# EAGLE schematic rt1060 (EAGLE 9.6.2), part 1 of 2

## Sheet 1 of 15
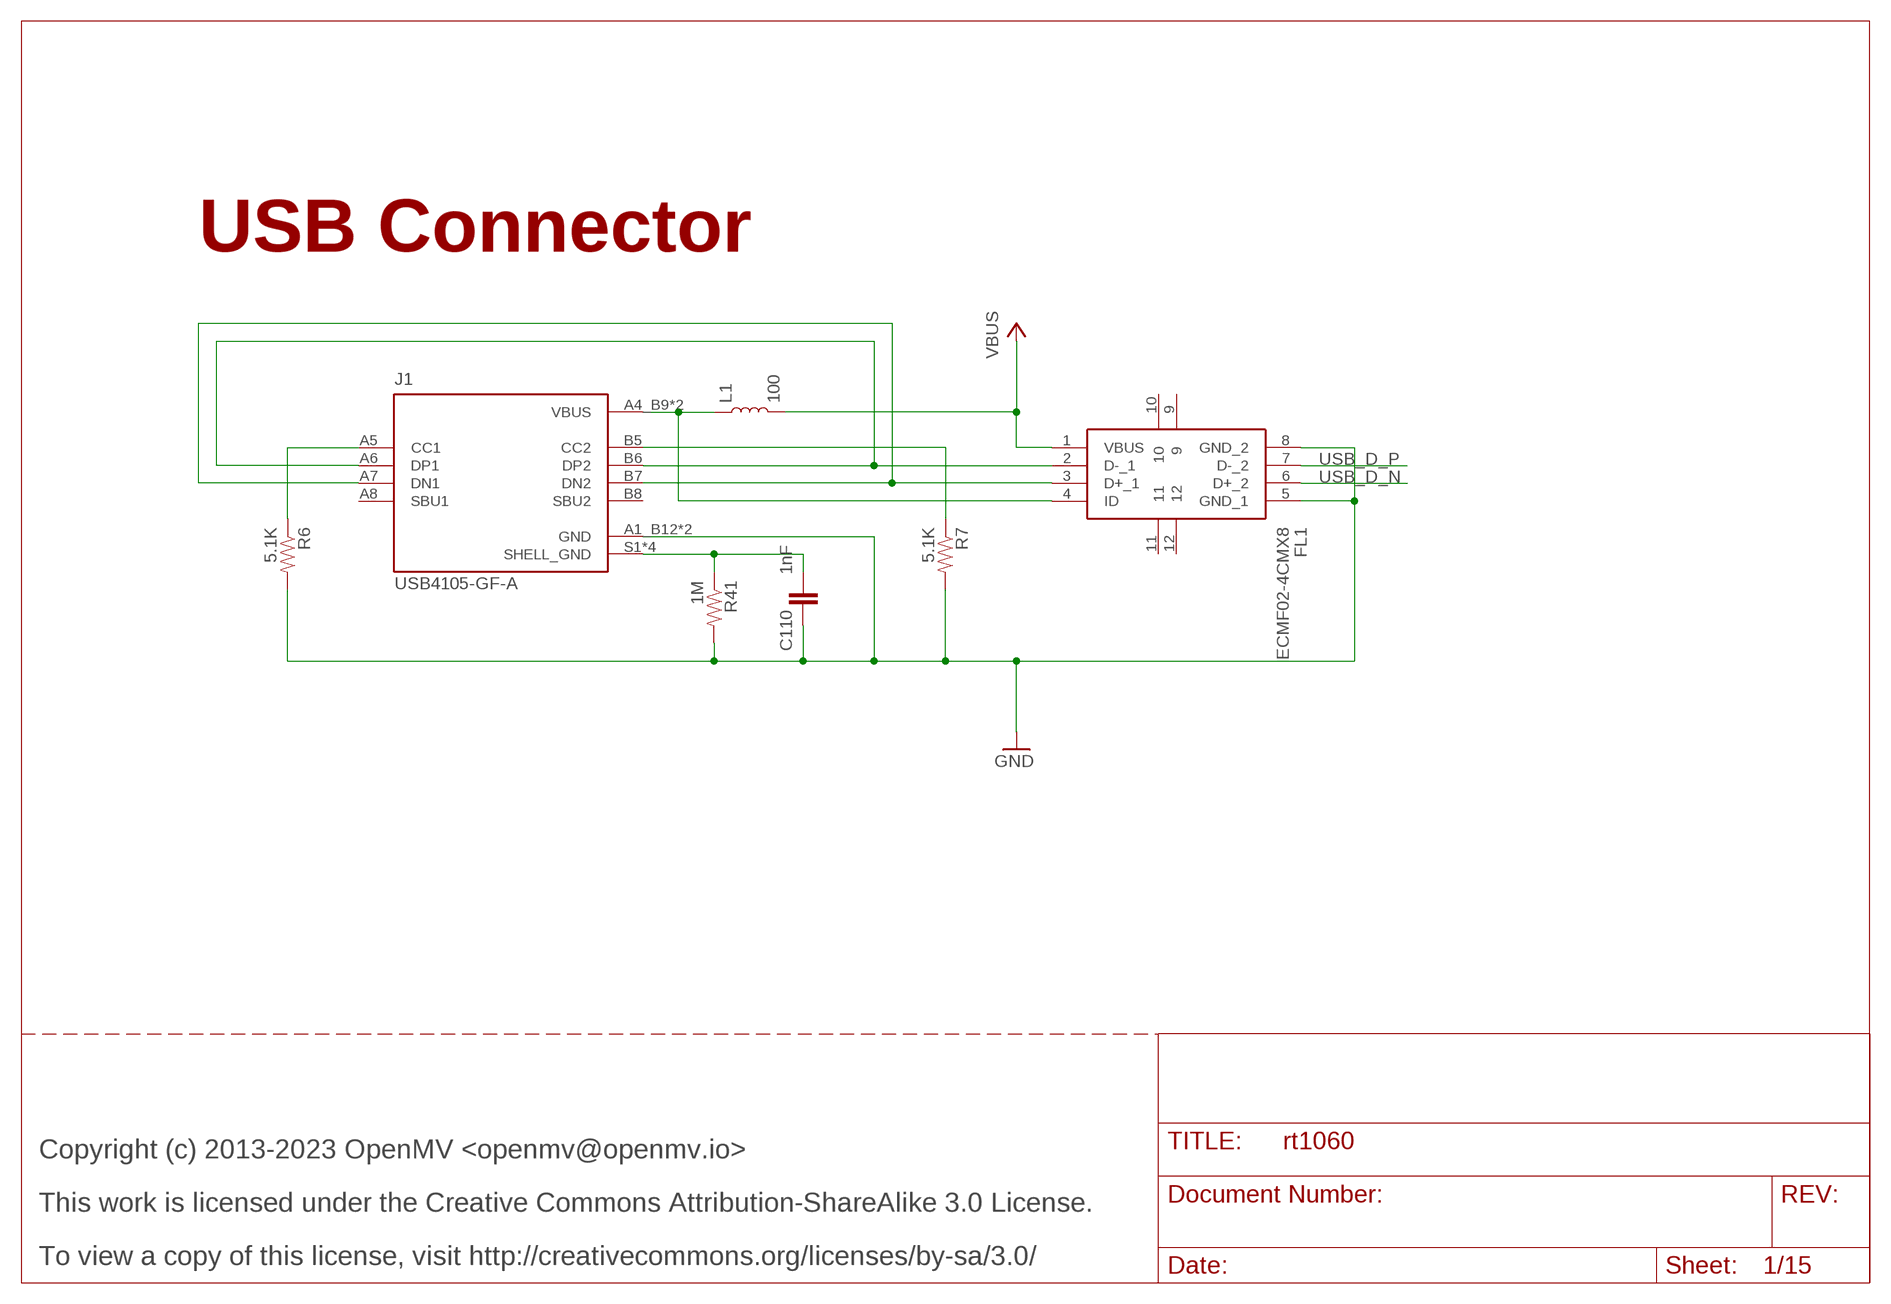
[diagram p0: schematic, sheet 1]

### Parts
C110  1nF  CAP0402-CAP  [0402-CAP]
FL1  ECMF02-4CMX8  [ECMF024CMX8]
J1  USB4105-GF-A  [GCT_USB4105-GF-A]
L1  100  INDUCTOR-0603-33NH  [0603]
R6  5.1K  RESISTOR0402-RES  [0402-RES]
R7  5.1K  RESISTOR0402-RES  [0402-RES]
R41  1M  RESISTOR0402-RES  [0402-RES]

### Nets
CC1: J1.A5(CC1) R6.1
CC2: J1.B5(CC2) R7.1
D_N [usb]: FL1.3(D+_1) J1.A7(DN1) J1.B7(DN2)
D_P [usb]: FL1.2(D-_1) J1.A6(DP1) J1.B6(DP2)
GND [gnd]: C110.1 FL1.5(GND_1) FL1.8(GND_2) J1.A1_B12(GND) J1.B1_A12(GND) R6.2 R7.2 R41.2 ; also sheet 2,3,4,5,6,7,8,9,10,11,12,13,14,15
SHELL_GND [power]: C110.2 J1.S1(SHELL_GND) J1.S2(SHELL_GND) J1.S3(SHELL_GND) J1.S4(SHELL_GND) R41.1
USB_D_N [usb]: FL1.6(D+_2) ; also sheet 15
USB_D_P [usb]: FL1.7(D-_2) ; also sheet 15
USB_VBUS: FL1.4(ID) J1.A4_B9(VBUS) J1.B4_A9(VBUS) L1.1
VBUS: FL1.1(VBUS) L1.2 ; also sheet 2,15
Unconnected: FL1.9 FL1.10 FL1.11 FL1.12 J1.A8(SBU1) J1.B8(SBU2)

### Notes on the sheet
- USB Connector
- Copyright (c) 2013-2023 OpenMV <openmv@openmv.io>
- This work is licensed under the Creative Commons Attribution-ShareAlike 3.0 License.
- To view a copy of this license, visit http://creativecommons.org/licenses/by-sa/3.0/

## Sheet 2 of 15
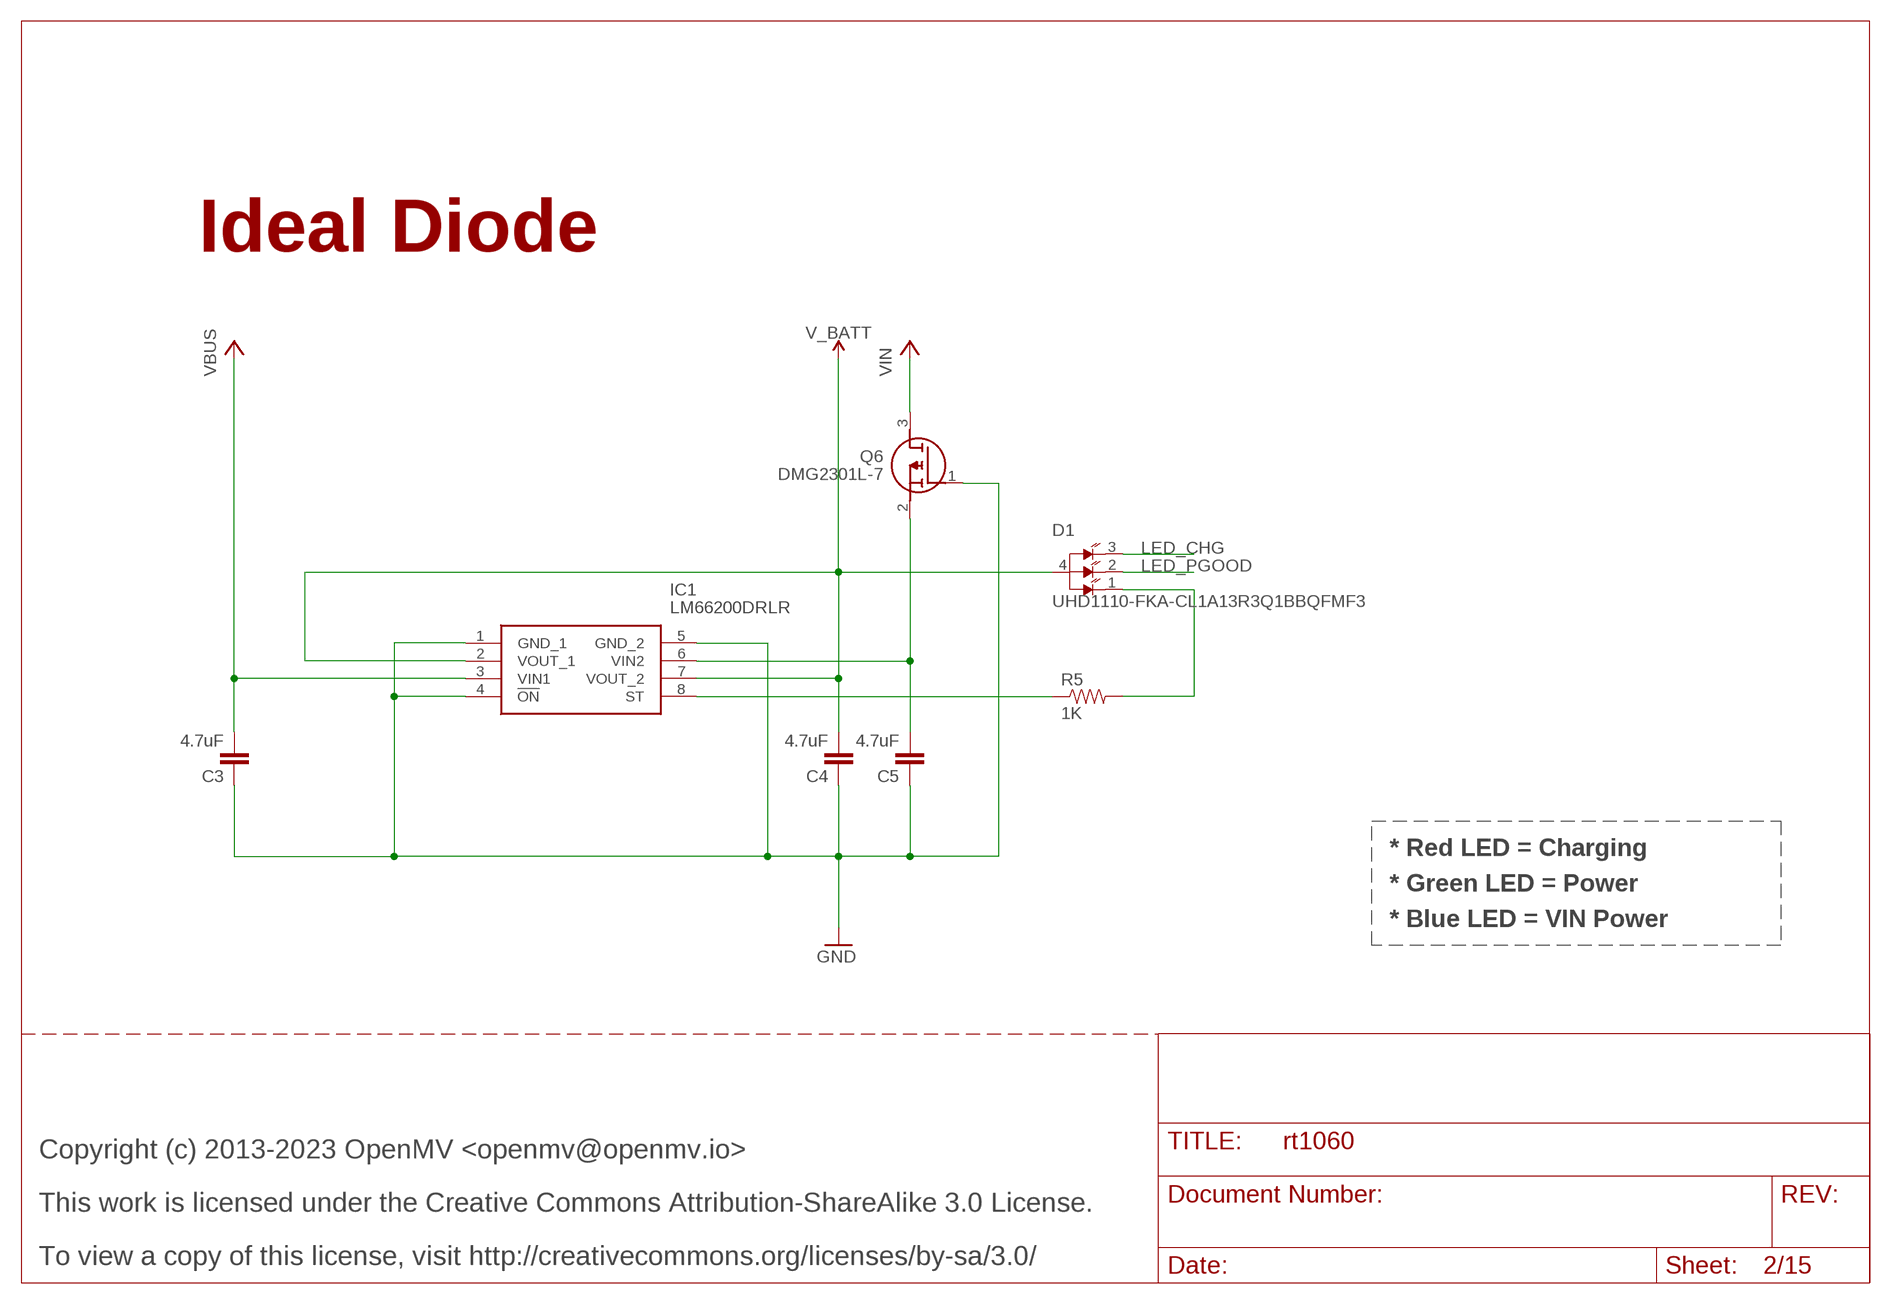
[diagram p1: schematic, sheet 2]

### Parts
C3  4.7uF  CAP0402-CAP  [0402-CAP]
C4  4.7uF  CAP0402-CAP  [0402-CAP]
C5  4.7uF  CAP0402-CAP  [0402-CAP]
D1  UHD1110-FKA-CL1A13R3Q1BBQFMF3  [LED_UHD1110-FKA-CL1A13R3Q1BBQFMF3]
IC1  LM66200DRLR  [SOTFL50P160X60-8N]
Q6  DMG2301L-7  [SOT96P240X110-3N]
R5  1K  RESISTOR0402-RES  [0402-RES]

### Nets
GND [gnd]: C3.1 C4.1 C5.1 IC1.1(GND_1) IC1.4(!ON) IC1.5(GND_2) Q6.1(G) ; also sheet 1,3,4,5,6,7,8,9,10,11,12,13,14,15
LED_CHG: D1.3(RED) ; also sheet 3
LED_PGOOD: D1.2(GREEN) ; also sheet 3
LED_ST: D1.1(BLUE) R5.2
ST: IC1.8(ST) R5.1
V_BATT [power]: C4.2 D1.4(ANODE) IC1.2(VOUT_1) IC1.7(VOUT_2) ; also sheet 3
VBUS: C3.2 IC1.3(VIN1) ; also sheet 1,15
VIN [power]: Q6.3(D) ; also sheet 11
VIN_INT [power]: C5.2 IC1.6(VIN2) Q6.2(S)

### Notes on the sheet
- Ideal Diode
- * Red LED = Charging
- * Green LED = Power
- * Blue LED = VIN Power
- Copyright (c) 2013-2023 OpenMV <openmv@openmv.io>
- This work is licensed under the Creative Commons Attribution-ShareAlike 3.0 License.
- To view a copy of this license, visit http://creativecommons.org/licenses/by-sa/3.0/

## Sheet 3 of 15
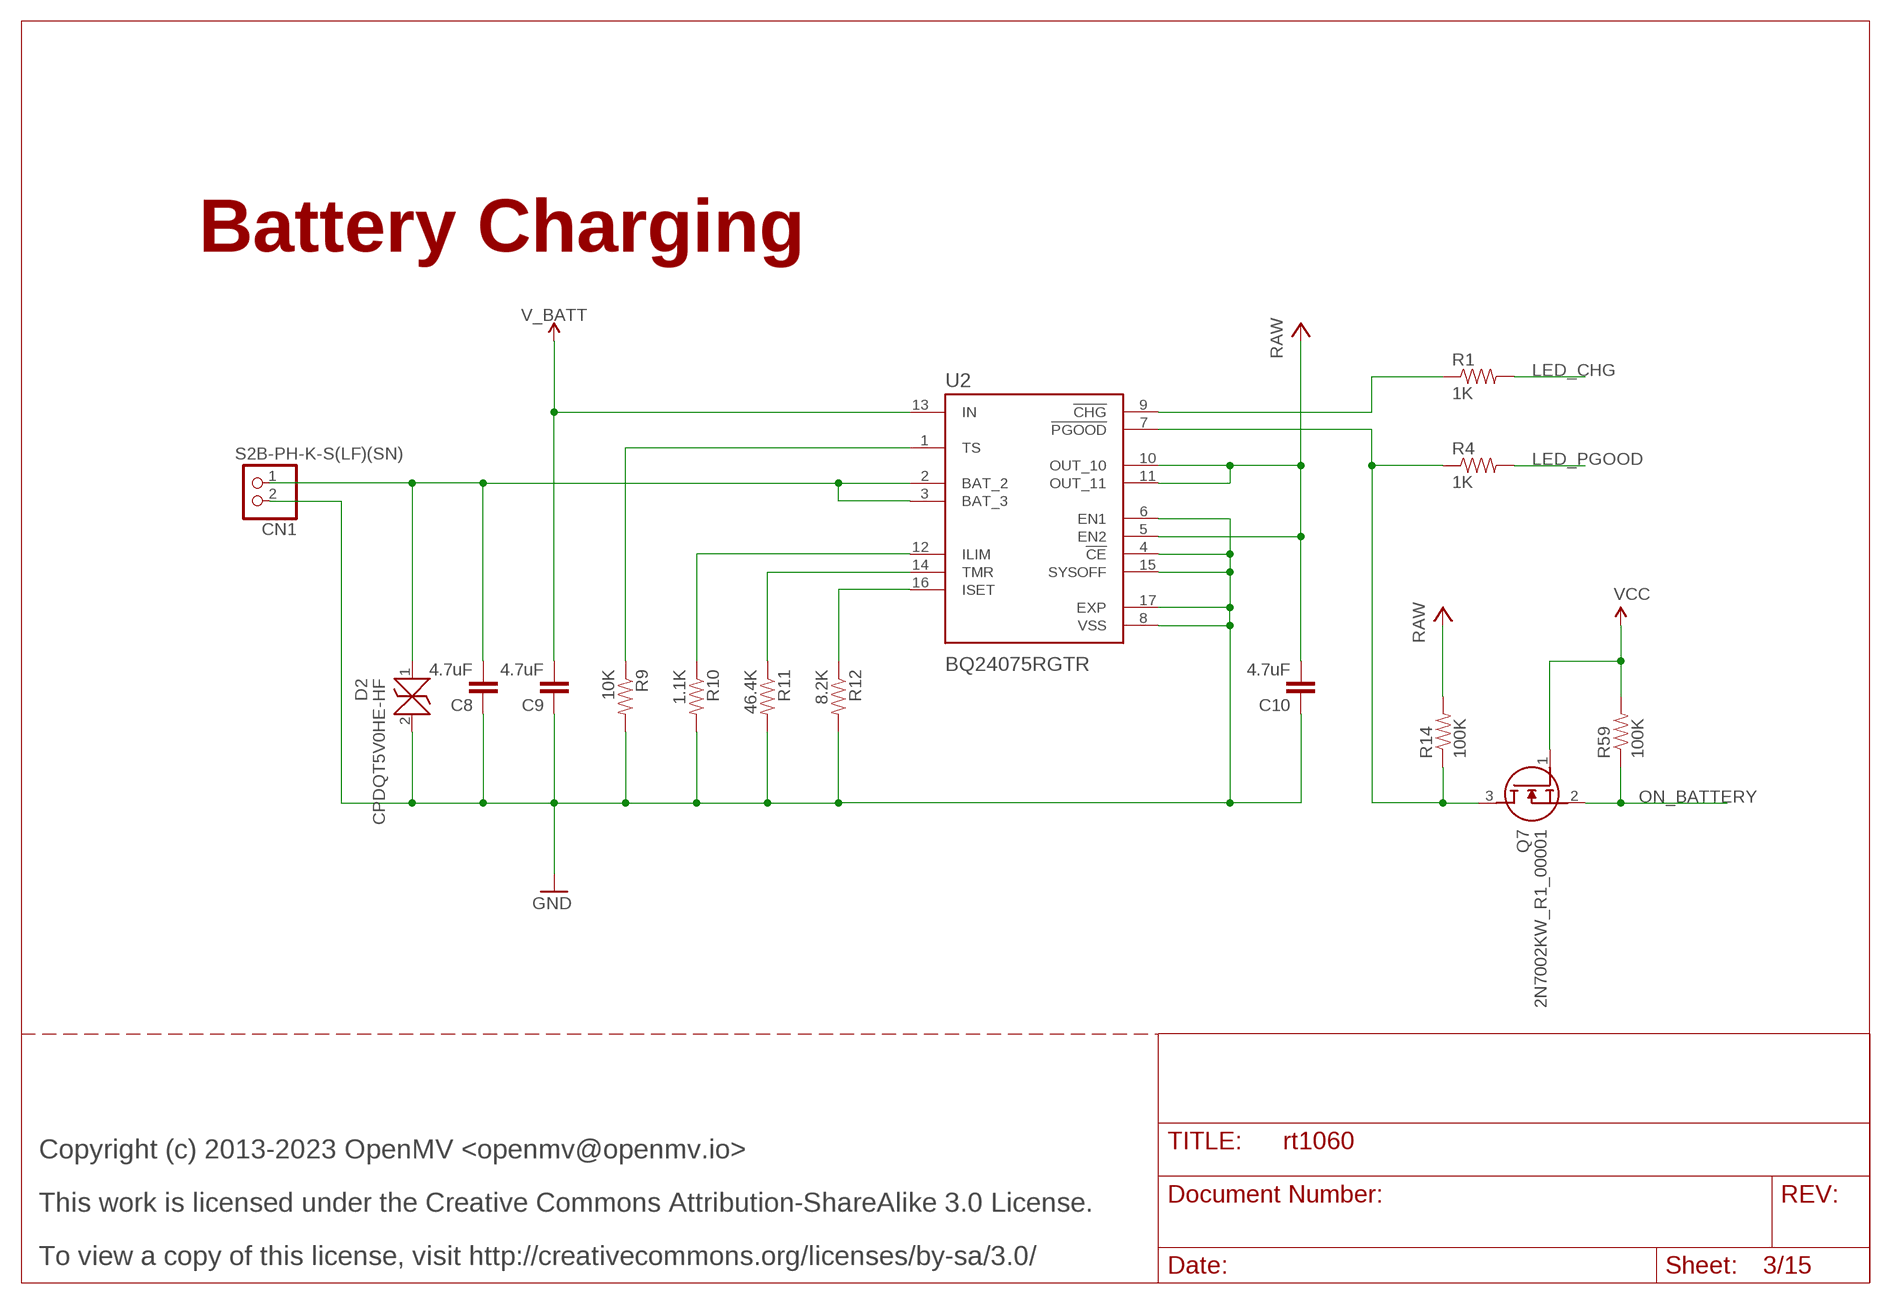
[diagram p2: schematic, sheet 3]

### Parts
C8  4.7uF  CAP0402-CAP  [0402-CAP]
C9  4.7uF  CAP0402-CAP  [0402-CAP]
C10  4.7uF  CAP0402-CAP  [0402-CAP]
CN1  S2B-PH-K-S(LF)(SN)  JST_2PIN-THM-RA  [JST-PH-2-THM-RA]
D2  CPDQT5V0HE-HF  [CPDQT5V0HEHF]
Q7  2N7002KW_R1_00001  [SOT65P210X110-3N]
R1  1K  RESISTOR0402-RES  [0402-RES]
R4  1K  RESISTOR0402-RES  [0402-RES]
R9  10K  RESISTOR0402-RES  [0402-RES]
R10  1.1K  RESISTOR0402-RES  [0402-RES]
R11  46.4K  RESISTOR0402-RES  [0402-RES]
R12  8.2K  RESISTOR0402-RES  [0402-RES]
R14  100K  RES_0402  [0402]
R59  100K  RES_0402  [0402]
U2  BQ24075RGTR  [QFN50P300X300X100-17N]

### Nets
BAT [power]: C8.2 CN1.1 D2.1 U2.2(BAT_2) U2.3(BAT_3)
CHG: R1.1 U2.9(!CHG)
GND [gnd]: C8.1 C9.1 C10.1 CN1.2 D2.2 R9.2 R10.2 R11.2 R12.2 U2.4(!CE) U2.6(EN1) U2.8(VSS) U2.15(SYSOFF) U2.17(EXP) ; also sheet 1,2,4,5,6,7,8,9,10,11,12,13,14,15
ILIM [power]: R10.1 U2.12(ILIM)
ISET [power]: R12.1 U2.16(ISET)
LED_CHG: R1.2 ; also sheet 2
LED_PGOOD: R4.2 ; also sheet 2
ON_BATTERY: Q7.2(S) R59.1 ; also sheet 15
PGOOD: Q7.3(D) R4.1 R14.1 U2.7(!PGOOD)
RAW: C10.2 R14.2 U2.5(EN2) U2.10(OUT_10) U2.11(OUT_11) ; also sheet 4,5,11
TMR [power]: R11.1 U2.14(TMR)
TS [power]: R9.1 U2.1(TS)
V_BATT [power]: C9.2 U2.13(IN) ; also sheet 2
VCC: Q7.1(G) R59.2 ; also sheet 5,6,7,8,9,10,11,12,13,14,15

### Notes on the sheet
- Battery Charging
- Copyright (c) 2013-2023 OpenMV <openmv@openmv.io>
- This work is licensed under the Creative Commons Attribution-ShareAlike 3.0 License.
- To view a copy of this license, visit http://creativecommons.org/licenses/by-sa/3.0/

## Sheet 4 of 15
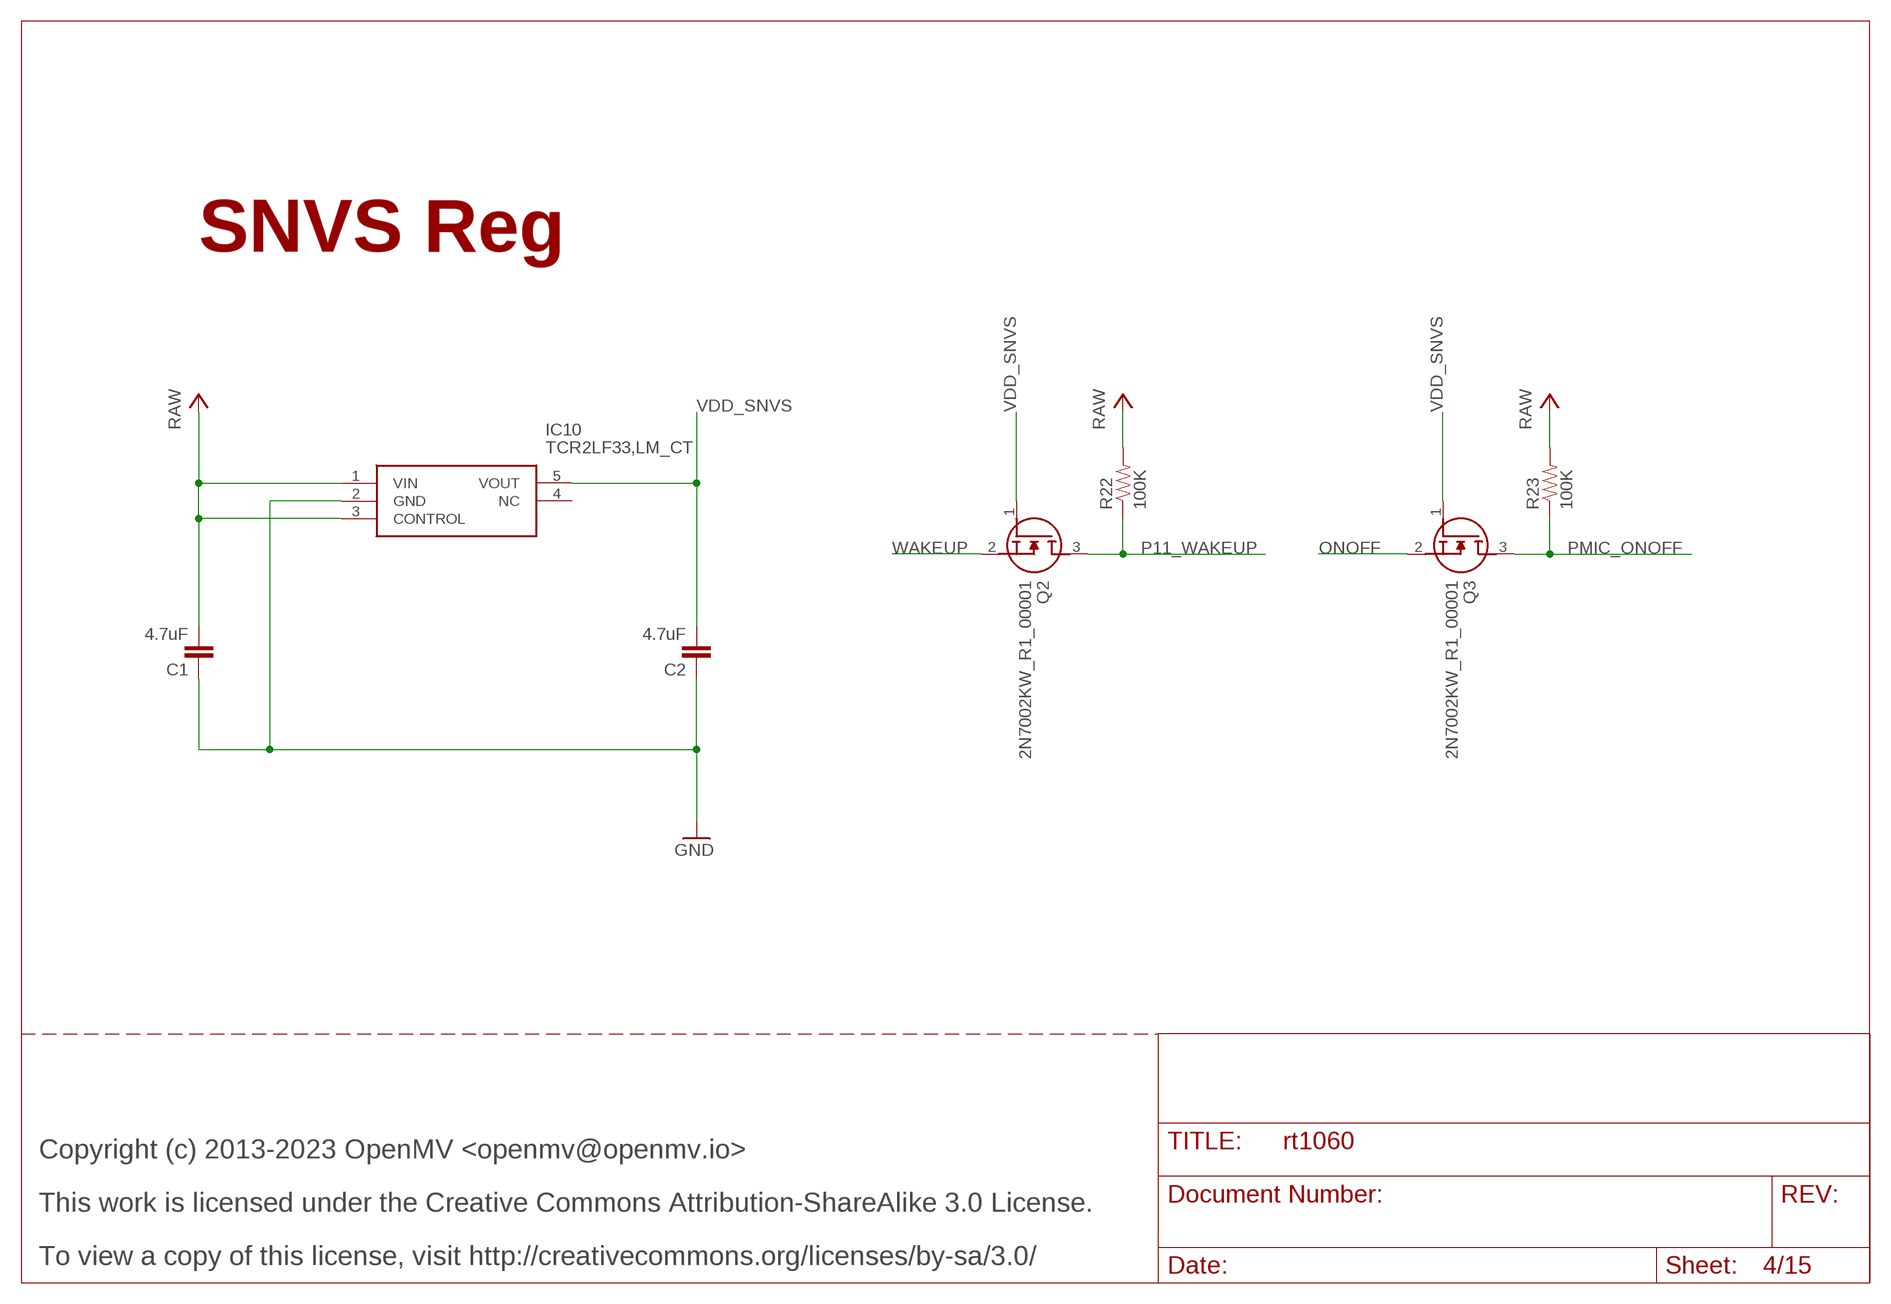
[diagram p3: schematic, sheet 4]

### Parts
C1  4.7uF  CAP0402-CAP  [0402-CAP]
C2  4.7uF  CAP0402-CAP  [0402-CAP]
IC10  TCR2LF33,LM_CT  [TCR2LF33LMCT]
Q2  2N7002KW_R1_00001  [SOT65P210X110-3N]
Q3  2N7002KW_R1_00001  [SOT65P210X110-3N]
R22  100K  RESISTOR0402-RES  [0402-RES]
R23  100K  RESISTOR0402-RES  [0402-RES]

### Nets
GND [gnd]: C1.1 C2.1 IC10.2(GND) ; also sheet 1,2,3,5,6,7,8,9,10,11,12,13,14,15
ONOFF: Q3.2(S) ; also sheet 15
P11_WAKEUP: Q2.3(D) R22.1 ; also sheet 11
PMIC_ONOFF: Q3.3(D) R23.1 ; also sheet 11
RAW: C1.2 IC10.1(VIN) IC10.3(CONTROL) R22.2 R23.2 ; also sheet 3,5,11
VDD_SNVS: C2.2 IC10.5(VOUT) Q2.1(G) Q3.1(G) ; also sheet 5,15
WAKEUP: Q2.2(S) ; also sheet 15
Unconnected: IC10.4(NC)

### Notes on the sheet
- SNVS Reg
- Copyright (c) 2013-2023 OpenMV <openmv@openmv.io>
- This work is licensed under the Creative Commons Attribution-ShareAlike 3.0 License.
- To view a copy of this license, visit http://creativecommons.org/licenses/by-sa/3.0/

## Sheet 5 of 15
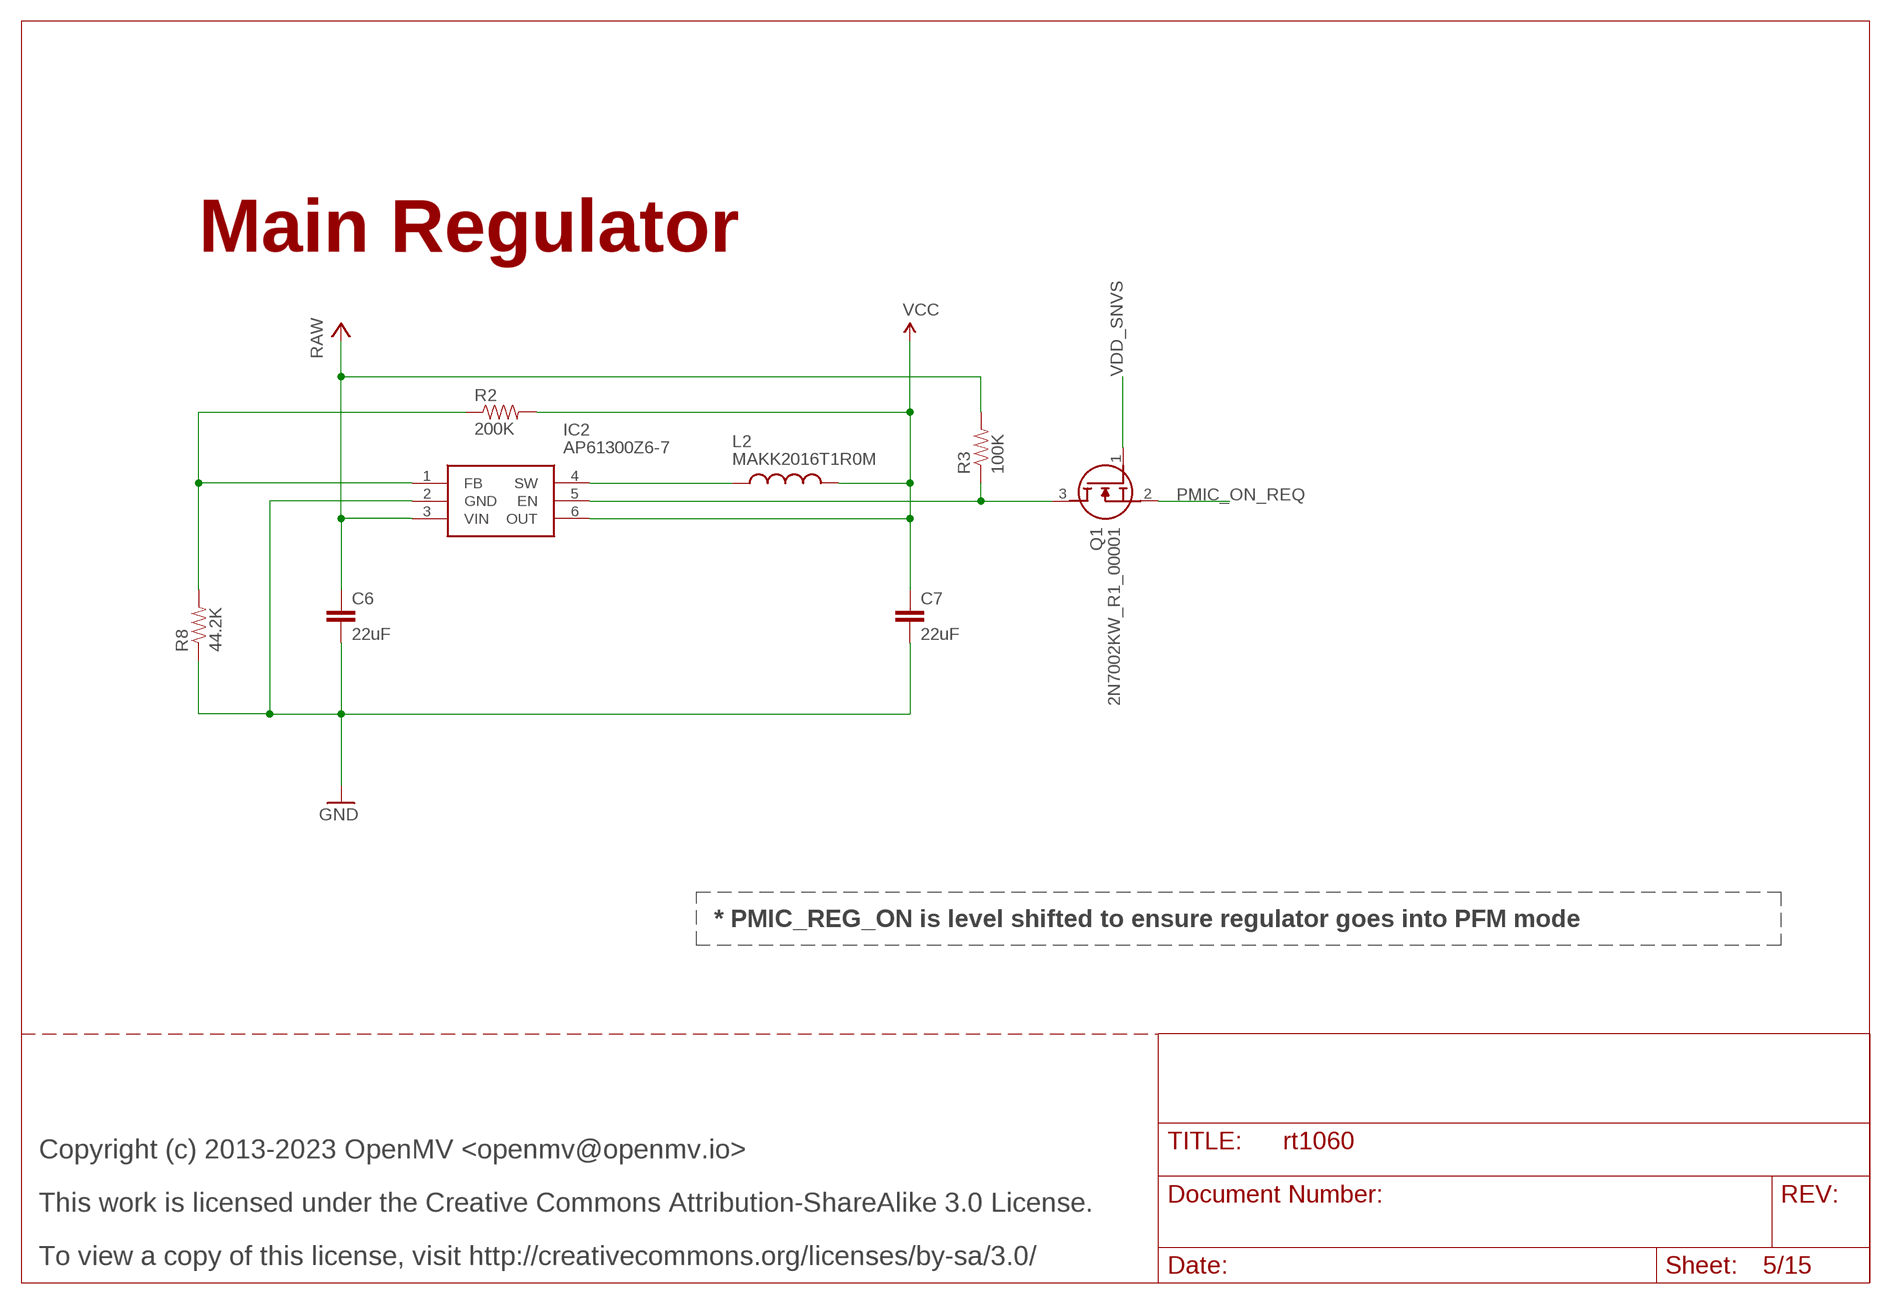
[diagram p4: schematic, sheet 5]

### Parts
C6  22uF  22UF-0805-6.3V-20%  [0805]
C7  22uF  22UF-0805-6.3V-20%  [0805]
IC2  AP61300Z6-7  [SOTFL50P162X60-6N]
L2  MAKK2016T1R0M  [INDC2016X100N]
Q1  2N7002KW_R1_00001  [SOT65P210X110-3N]
R2  200K  RESISTOR0402-RES  [0402-RES]
R3  100K  RESISTOR0402-RES  [0402-RES]
R8  44.2K  RESISTOR0402-RES  [0402-RES]

### Nets
EN: IC2.5(EN) Q1.3(D) R3.1
FB [power]: IC2.1(FB) R2.1 R8.2
GND [gnd]: C6.2 C7.2 IC2.2(GND) R8.1 ; also sheet 1,2,3,4,6,7,8,9,10,11,12,13,14,15
PMIC_ON_REQ: Q1.2(S) ; also sheet 15
RAW: C6.1 IC2.3(VIN) R3.2 ; also sheet 3,4,11
SW [power]: IC2.4(SW) L2.1
VCC: C7.1 IC2.6(OUT) L2.2 R2.2 ; also sheet 3,6,7,8,9,10,11,12,13,14,15
VDD_SNVS: Q1.1(G) ; also sheet 4,15

### Notes on the sheet
- Main Regulator
- * PMIC_REG_ON is level shifted to ensure regulator goes into PFM mode
- Copyright (c) 2013-2023 OpenMV <openmv@openmv.io>
- This work is licensed under the Creative Commons Attribution-ShareAlike 3.0 License.
- To view a copy of this license, visit http://creativecommons.org/licenses/by-sa/3.0/

## Sheet 6 of 15
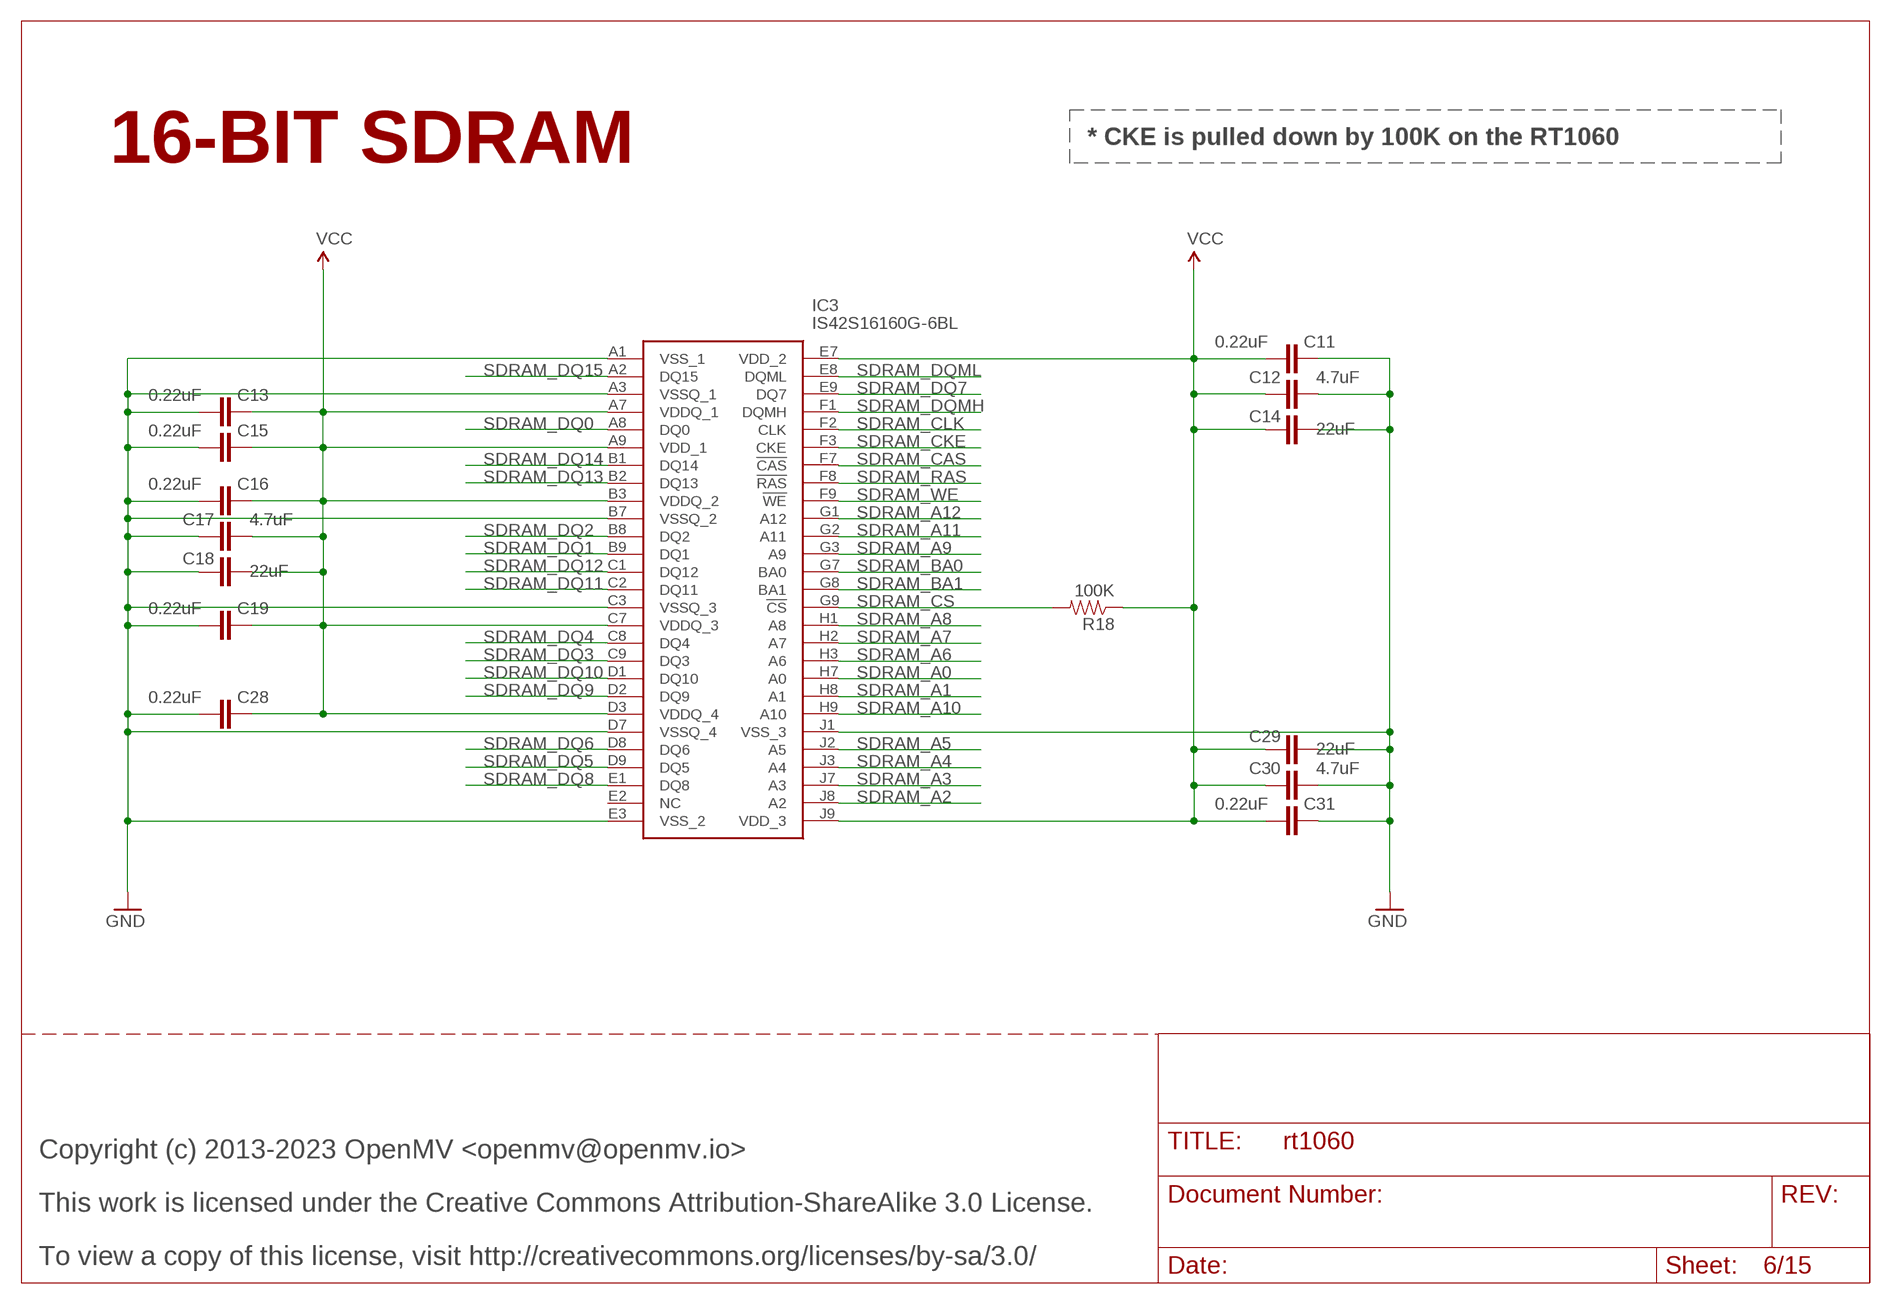
[diagram p5: schematic, sheet 6]

### Parts
C11  0.22uF  C-EUC0201  [C0201]
C12  4.7uF  CAP0402-CAP  [0402-CAP]
C13  0.22uF  C-EUC0201  [C0201]
C14  22uF  22UF-0805-6.3V-20%  [0805]
C15  0.22uF  C-EUC0201  [C0201]
C16  0.22uF  C-EUC0201  [C0201]
C17  4.7uF  CAP0402-CAP  [0402-CAP]
C18  22uF  22UF-0805-6.3V-20%  [0805]
C19  0.22uF  C-EUC0201  [C0201]
C28  0.22uF  C-EUC0201  [C0201]
C29  22uF  22UF-0805-6.3V-20%  [0805]
C30  4.7uF  CAP0402-CAP  [0402-CAP]
C31  0.22uF  C-EUC0201  [C0201]
IC3  IS42S16160G-6BL  [BGA54C80P9X9_800X800X120]
R18  100K  RESISTOR0402-RES  [0402-RES]

### Nets
GND [gnd]: C11.1 C12.2 C13.2 C14.2 C15.2 C16.2 C17.1 C18.1 C19.2 C28.2 C29.2 C30.2 C31.1 IC3.A1(VSS_1) IC3.A3(VSSQ_1) IC3.B7(VSSQ_2) IC3.C3(VSSQ_3) IC3.D7(VSSQ_4) IC3.E3(VSS_2) IC3.J1(VSS_3) ; also sheet 1,2,3,4,5,7,8,9,10,11,12,13,14,15
SDRAM_A0 [sdram]: IC3.H7(A0) ; also sheet 15
SDRAM_A1 [sdram]: IC3.H8(A1) ; also sheet 15
SDRAM_A2 [sdram]: IC3.J8(A2) ; also sheet 15
SDRAM_A3 [sdram]: IC3.J7(A3) ; also sheet 15
SDRAM_A4 [sdram]: IC3.J3(A4) ; also sheet 15
SDRAM_A5 [sdram]: IC3.J2(A5) ; also sheet 15
SDRAM_A6 [sdram]: IC3.H3(A6) ; also sheet 15
SDRAM_A7 [sdram]: IC3.H2(A7) ; also sheet 15
SDRAM_A8 [sdram]: IC3.H1(A8) ; also sheet 15
SDRAM_A9 [sdram]: IC3.G3(A9) ; also sheet 15
SDRAM_A10 [sdram]: IC3.H9(A10) ; also sheet 15
SDRAM_A11 [sdram]: IC3.G2(A11) ; also sheet 15
SDRAM_A12 [sdram]: IC3.G1(A12) ; also sheet 15
SDRAM_BA0 [sdram]: IC3.G7(BA0) ; also sheet 15
SDRAM_BA1 [sdram]: IC3.G8(BA1) ; also sheet 15
SDRAM_CAS [sdram]: IC3.F7(!CAS) ; also sheet 15
SDRAM_CKE [sdram]: IC3.F3(CKE) ; also sheet 15
SDRAM_CLK [sdram]: IC3.F2(CLK) ; also sheet 15
SDRAM_CS [sdram]: IC3.G9(!CS) R18.2 ; also sheet 15
SDRAM_DQ0 [sdram]: IC3.A8(DQ0) ; also sheet 15
SDRAM_DQ1 [sdram]: IC3.B9(DQ1) ; also sheet 15
SDRAM_DQ2 [sdram]: IC3.B8(DQ2) ; also sheet 15
SDRAM_DQ3 [sdram]: IC3.C9(DQ3) ; also sheet 15
SDRAM_DQ4 [sdram]: IC3.C8(DQ4) ; also sheet 15
SDRAM_DQ5 [sdram]: IC3.D9(DQ5) ; also sheet 15
SDRAM_DQ6 [sdram]: IC3.D8(DQ6) ; also sheet 15
SDRAM_DQ7 [sdram]: IC3.E9(DQ7) ; also sheet 15
SDRAM_DQ8 [sdram]: IC3.E1(DQ8) ; also sheet 15
SDRAM_DQ9 [sdram]: IC3.D2(DQ9) ; also sheet 15
SDRAM_DQ10 [sdram]: IC3.D1(DQ10) ; also sheet 15
SDRAM_DQ11 [sdram]: IC3.C2(DQ11) ; also sheet 15
SDRAM_DQ12 [sdram]: IC3.C1(DQ12) ; also sheet 15
SDRAM_DQ13 [sdram]: IC3.B2(DQ13) ; also sheet 15
SDRAM_DQ14 [sdram]: IC3.B1(DQ14) ; also sheet 15
SDRAM_DQ15 [sdram]: IC3.A2(DQ15) ; also sheet 15
SDRAM_DQMH [sdram]: IC3.F1(DQMH) ; also sheet 15
SDRAM_DQML [sdram]: IC3.E8(DQML) ; also sheet 15
SDRAM_RAS [sdram]: IC3.F8(!RAS) ; also sheet 15
SDRAM_WE [sdram]: IC3.F9(!WE) ; also sheet 15
VCC: C11.2 C12.1 C13.1 C14.1 C15.1 C16.1 C17.2 C18.2 C19.1 C28.1 C29.1 C30.1 C31.2 IC3.A7(VDDQ_1) IC3.A9(VDD_1) IC3.B3(VDDQ_2) IC3.C7(VDDQ_3) IC3.D3(VDDQ_4) IC3.E7(VDD_2) IC3.J9(VDD_3) R18.1 ; also sheet 3,5,7,8,9,10,11,12,13,14,15
Unconnected: IC3.E2(NC)

### Notes on the sheet
- * CKE is pulled down by 100K on the RT1060
- 16-BIT SDRAM
- Copyright (c) 2013-2023 OpenMV <openmv@openmv.io>
- This work is licensed under the Creative Commons Attribution-ShareAlike 3.0 License.
- To view a copy of this license, visit http://creativecommons.org/licenses/by-sa/3.0/

## Sheet 7 of 15
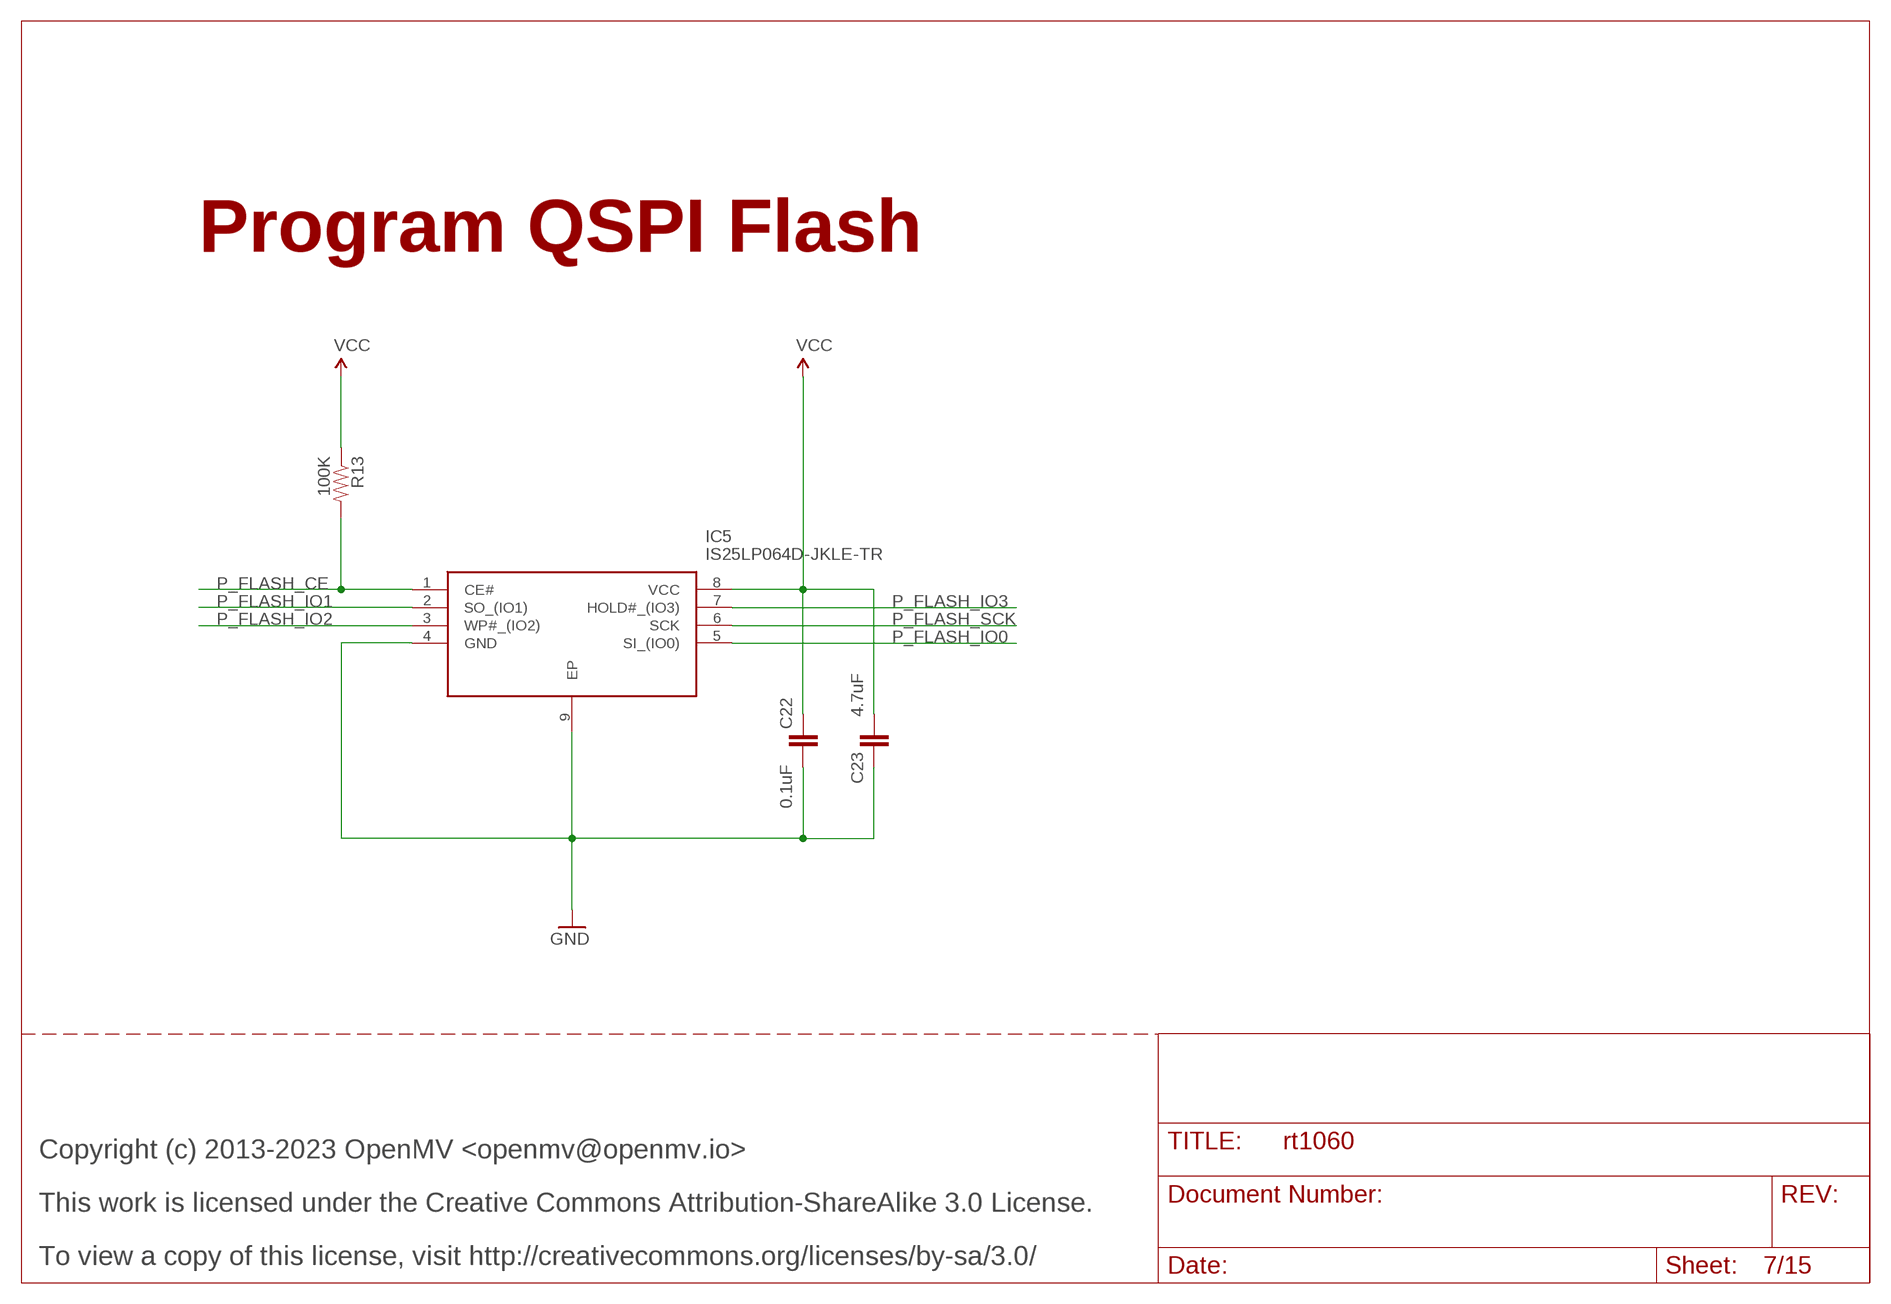
[diagram p6: schematic, sheet 7]

### Parts
C22  0.1uF  CAP_0402  [0402]
C23  4.7uF  CAP0402-CAP  [0402-CAP]
IC5  IS25LP064D-JKLE-TR  [SON127P500X595X80-9N]
R13  100K  RESISTOR0402-RES  [0402-RES]

### Nets
GND [gnd]: C22.2 C23.1 IC5.4(GND) IC5.9(EP) ; also sheet 1,2,3,4,5,6,8,9,10,11,12,13,14,15
P_FLASH_CE [flash]: IC5.1(CE#) R13.2 ; also sheet 15
P_FLASH_IO0 [flash]: IC5.5(SI_(IO0)) ; also sheet 15
P_FLASH_IO1 [flash]: IC5.2(SO_(IO1)) ; also sheet 15
P_FLASH_IO2 [flash]: IC5.3(WP#_(IO2)) ; also sheet 15
P_FLASH_IO3 [flash]: IC5.7(HOLD#_(IO3)) ; also sheet 15
P_FLASH_SCK [flash]: IC5.6(SCK) ; also sheet 15
VCC: C22.1 C23.2 IC5.8(VCC) R13.1 ; also sheet 3,5,6,8,9,10,11,12,13,14,15

### Notes on the sheet
- Program QSPI Flash
- Copyright (c) 2013-2023 OpenMV <openmv@openmv.io>
- This work is licensed under the Creative Commons Attribution-ShareAlike 3.0 License.
- To view a copy of this license, visit http://creativecommons.org/licenses/by-sa/3.0/

## Sheet 8 of 15
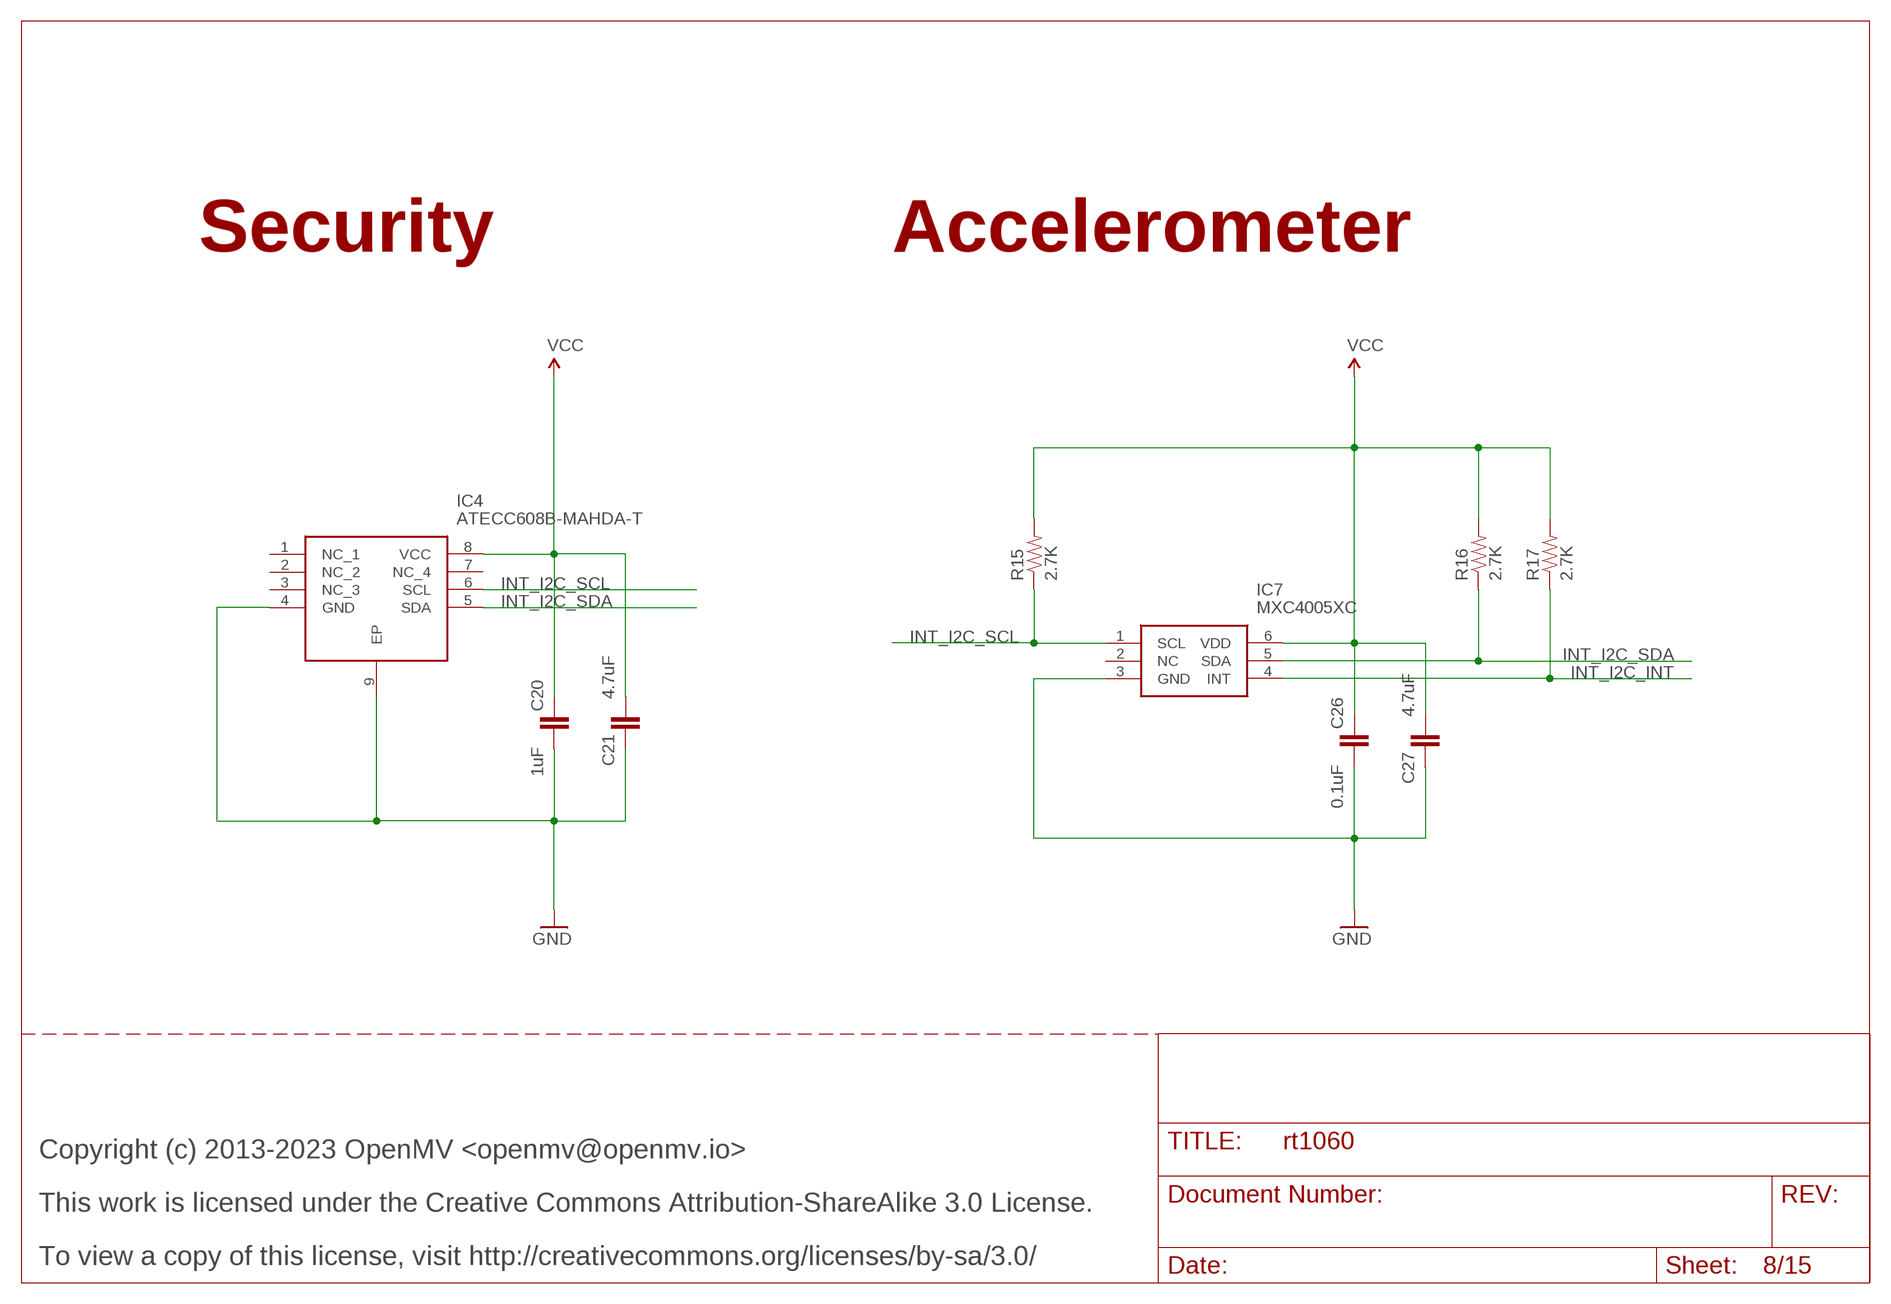
[diagram p7: schematic, sheet 8]

### Parts
C20  1uF  CAP_0402  [0402]
C21  4.7uF  CAP0402-CAP  [0402-CAP]
C26  0.1uF  CAP_0402  [0402]
C27  4.7uF  CAP0402-CAP  [0402-CAP]
IC4  ATECC608B-MAHDA-T  [SON50P300X200X60-9N]
IC7  MXC4005XC  [MXC4005XC]
R15  2.7K  RESISTOR0402-RES  [0402-RES]
R16  2.7K  RESISTOR0402-RES  [0402-RES]
R17  2.7K  RESISTOR0402-RES  [0402-RES]

### Nets
GND [gnd]: C20.2 C21.1 C26.2 C27.1 IC4.4(GND) IC4.9(EP) IC7.3(GND) ; also sheet 1,2,3,4,5,6,7,9,10,11,12,13,14,15
INT_I2C_INT: IC7.4(INT) R17.1 ; also sheet 15
INT_I2C_SCL [i2c]: IC4.6(SCL) IC7.1(SCL) R15.1 ; also sheet 15
INT_I2C_SDA [i2c]: IC4.5(SDA) IC7.5(SDA) R16.1 ; also sheet 15
VCC: C20.1 C21.2 C26.1 C27.2 IC4.8(VCC) IC7.6(VDD) R15.2 R16.2 R17.2 ; also sheet 3,5,6,7,9,10,11,12,13,14,15
Unconnected: IC4.1(NC_1) IC4.2(NC_2) IC4.3(NC_3) IC4.7(NC_4) IC7.2(NC)

### Notes on the sheet
- Security | Accelerometer
- Copyright (c) 2013-2023 OpenMV <openmv@openmv.io>
- This work is licensed under the Creative Commons Attribution-ShareAlike 3.0 License.
- To view a copy of this license, visit http://creativecommons.org/licenses/by-sa/3.0/

## Sheet 9 of 15
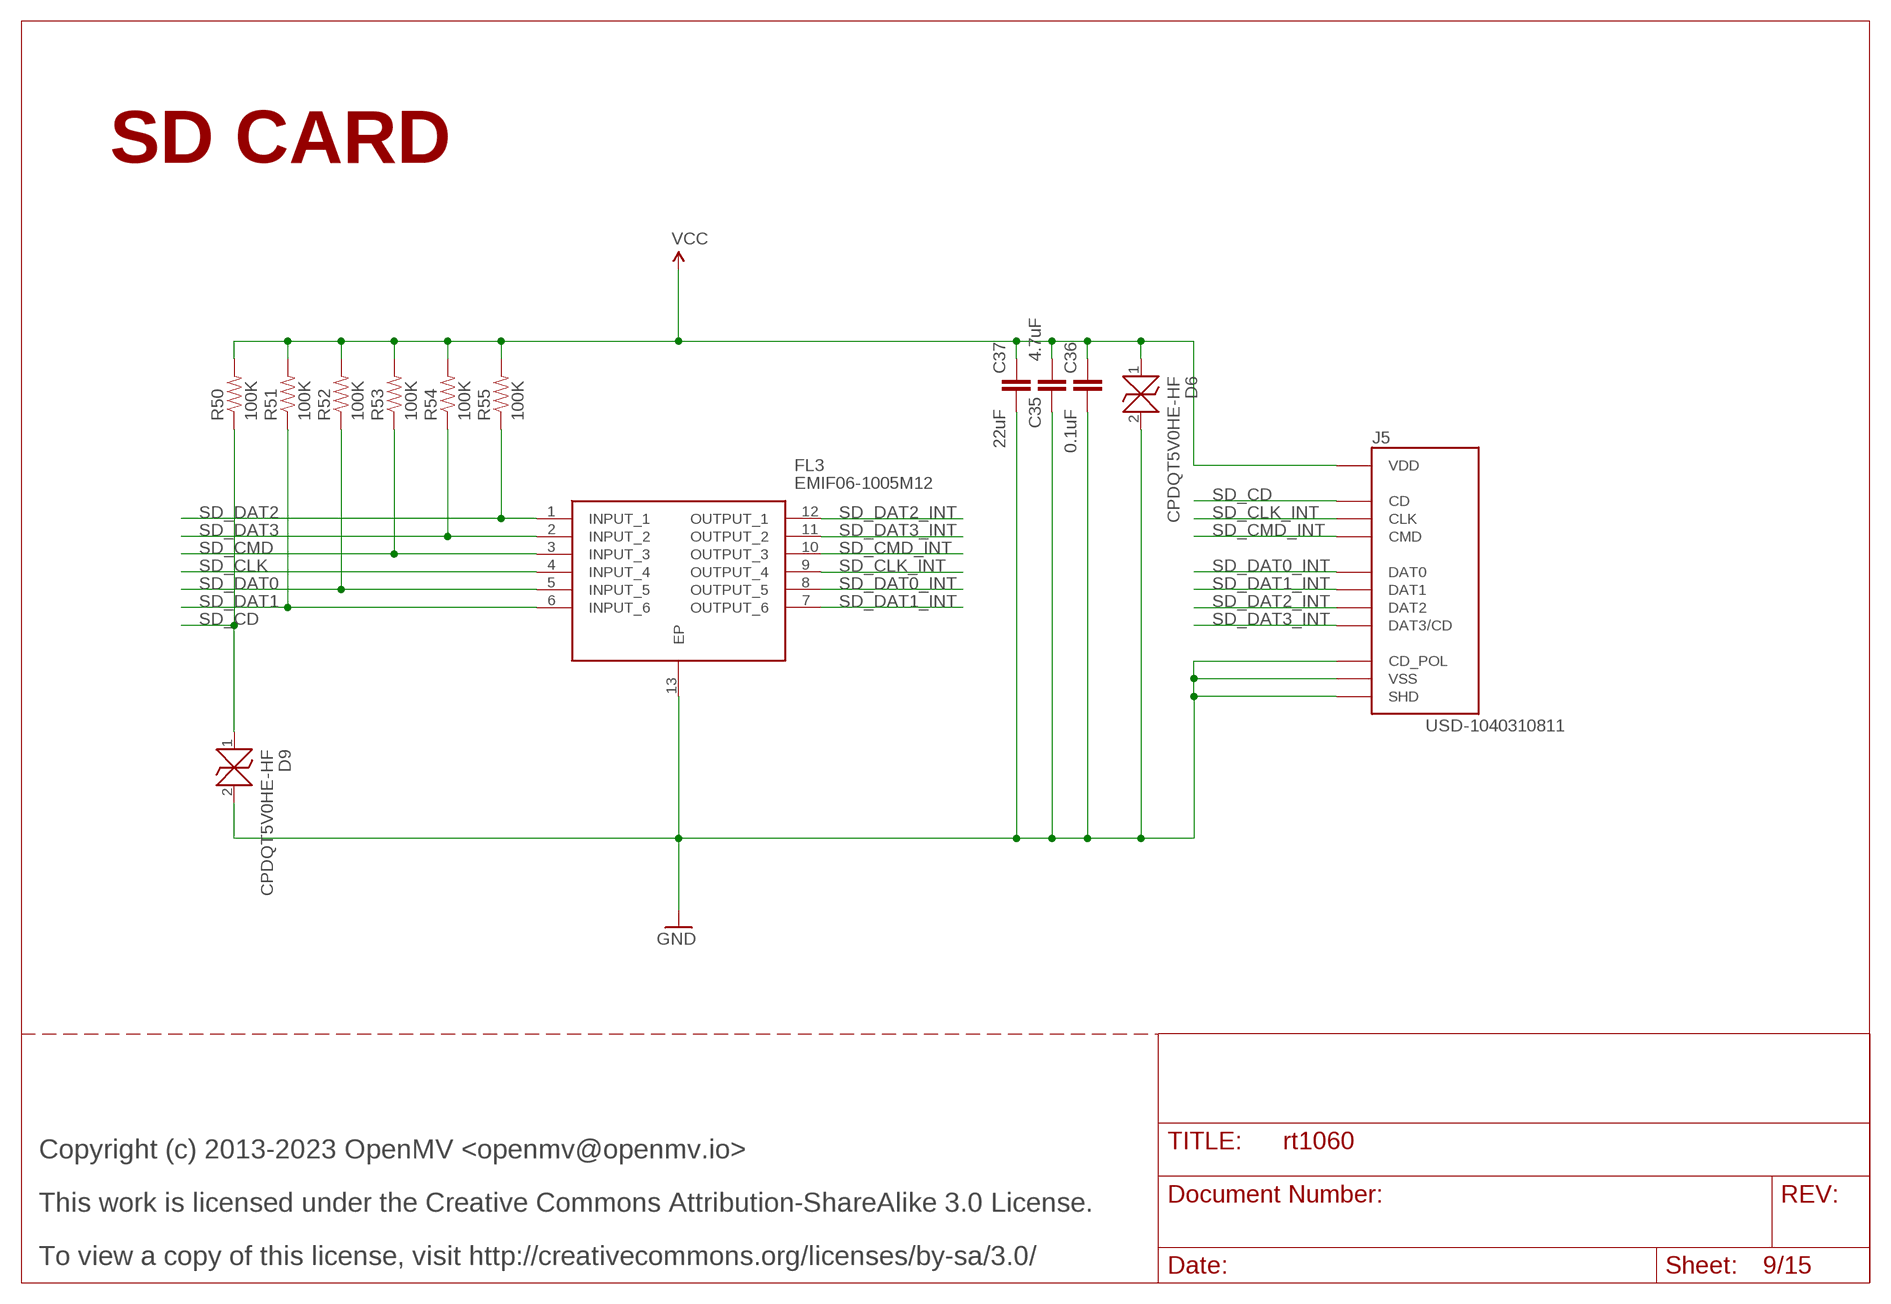
[diagram p8: schematic, sheet 9]

### Parts
C35  4.7uF  CAP0402-CAP  [0402-CAP]
C36  0.1uF  CAP_0402  [0402]
C37  22uF  22UF-0805-6.3V-20%  [0805]
D6  CPDQT5V0HE-HF  [CPDQT5V0HEHF]
D9  CPDQT5V0HE-HF  [CPDQT5V0HEHF]
FL3  EMIF06-1005M12  [SON40P150X250X65-13N]
J5  USD-1040310811  [1040310811]
R50  100K  RES_0402  [0402]
R51  100K  RES_0402  [0402]
R52  100K  RES_0402  [0402]
R53  100K  RES_0402  [0402]
R54  100K  RES_0402  [0402]
R55  100K  RES_0402  [0402]

### Nets
GND [gnd]: C35.1 C36.2 C37.2 D6.2 D9.2 FL3.13(EP) J5.CD$2(CD_POL) J5.G$1(SHD) J5.G$2(SHD) J5.G$3(SHD) J5.G$4(SHD) J5.P$6(VSS) ; also sheet 1,2,3,4,5,6,7,8,10,11,12,13,14,15
SD_CD: D9.1 J5.CD$1(CD) R50.1 ; also sheet 15
SD_CLK [sdcard]: FL3.4(INPUT_4) ; also sheet 15
SD_CLK_INT [sdcard]: FL3.9(OUTPUT_4) J5.P$5(CLK)
SD_CMD [sdcard]: FL3.3(INPUT_3) R53.1 ; also sheet 15
SD_CMD_INT [sdcard]: FL3.10(OUTPUT_3) J5.P$3(CMD)
SD_DAT0 [sdcard]: FL3.5(INPUT_5) R52.1 ; also sheet 15
SD_DAT0_INT: FL3.8(OUTPUT_5) J5.P$7(DAT0)
SD_DAT1 [sdcard]: FL3.6(INPUT_6) R51.1 ; also sheet 15
SD_DAT1_INT: FL3.7(OUTPUT_6) J5.P$8(DAT1)
SD_DAT2 [sdcard]: FL3.1(INPUT_1) R55.1 ; also sheet 15
SD_DAT2_INT [sdcard]: FL3.12(OUTPUT_1) J5.P$1(DAT2)
SD_DAT3 [sdcard]: FL3.2(INPUT_2) R54.1 ; also sheet 15
SD_DAT3_INT [sdcard]: FL3.11(OUTPUT_2) J5.P$2(DAT3/CD)
VCC: C35.2 C36.1 C37.1 D6.1 J5.P$4(VDD) R50.2 R51.2 R52.2 R53.2 R54.2 R55.2 ; also sheet 3,5,6,7,8,10,11,12,13,14,15

### Notes on the sheet
- SD CARD
- Copyright (c) 2013-2023 OpenMV <openmv@openmv.io>
- This work is licensed under the Creative Commons Attribution-ShareAlike 3.0 License.
- To view a copy of this license, visit http://creativecommons.org/licenses/by-sa/3.0/

## Sheet 10 of 15
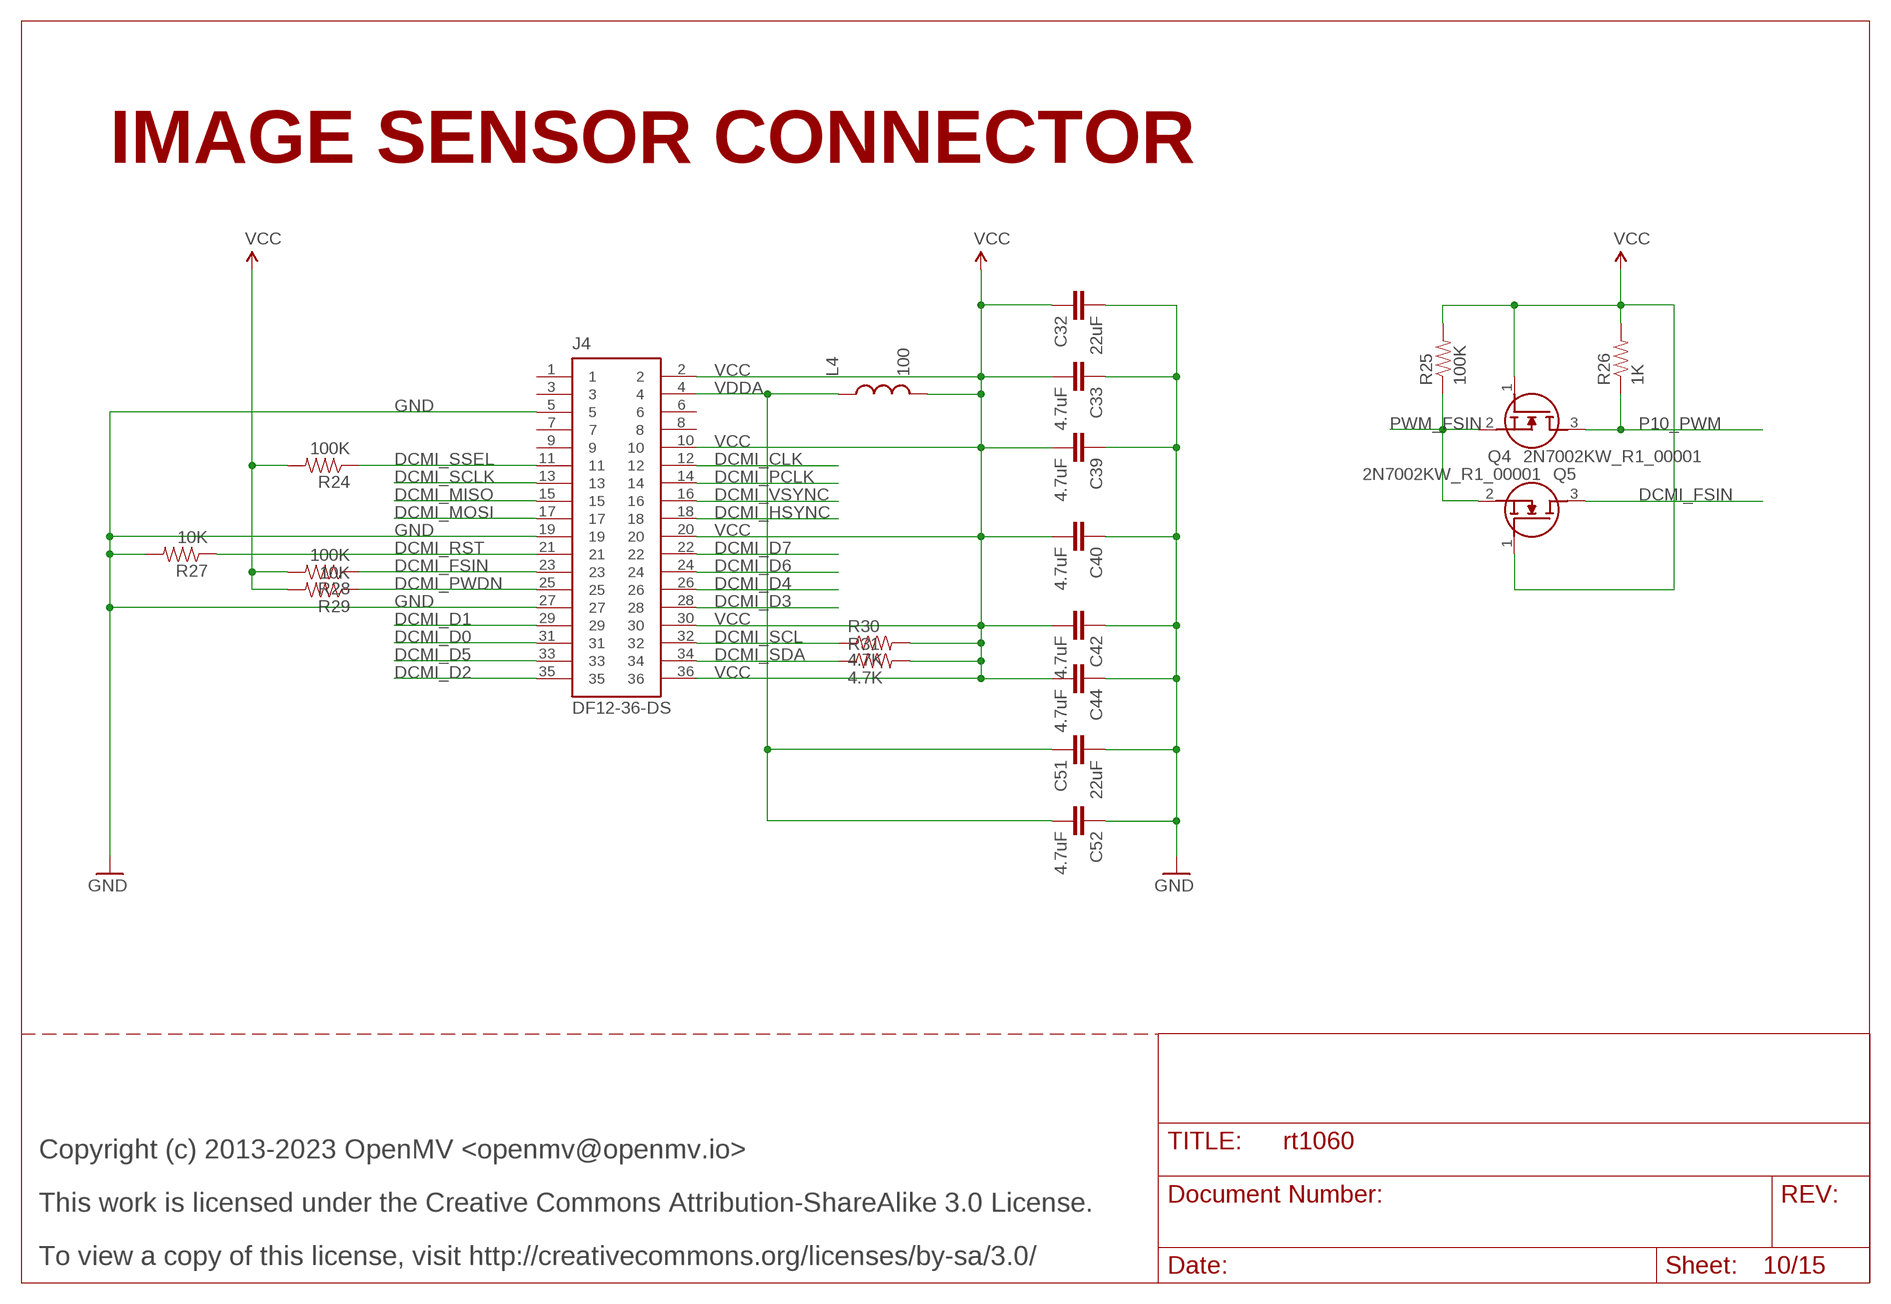
[diagram p9: schematic, sheet 10]

### Parts
C32  22uF  22UF-0805-6.3V-20%  [0805]
C33  4.7uF  CAP0402-CAP  [0402-CAP]
C39  4.7uF  CAP0402-CAP  [0402-CAP]
C40  4.7uF  CAP0402-CAP  [0402-CAP]
C42  4.7uF  CAP0402-CAP  [0402-CAP]
C44  4.7uF  CAP0402-CAP  [0402-CAP]
C51  22uF  22UF-0805-6.3V-20%  [0805]
C52  4.7uF  CAP0402-CAP  [0402-CAP]
J4  DF12-36-DS  [DF12-36-DS]
L4  100  INDUCTOR0402  [C0402]
Q4  2N7002KW_R1_00001  [SOT65P210X110-3N]
Q5  2N7002KW_R1_00001  [SOT65P210X110-3N]
R24  100K  RESISTOR0402-RES  [0402-RES]
R25  100K  RESISTOR0402-RES  [0402-RES]
R26  1K  RESISTOR0402-RES  [0402-RES]
R27  10K  RESISTOR0402-RES  [0402-RES]
R28  100K  RESISTOR0402-RES  [0402-RES]
R29  10K  RESISTOR0402-RES  [0402-RES]
R30  4.7K  RESISTOR0402-RES  [0402-RES]
R31  4.7K  RESISTOR0402-RES  [0402-RES]

### Nets
DCMI_CLK: J4.12 ; also sheet 15
DCMI_D0 [dcmi]: J4.31 ; also sheet 15
DCMI_D1 [dcmi]: J4.29 ; also sheet 15
DCMI_D2 [dcmi]: J4.35 ; also sheet 15
DCMI_D3 [dcmi]: J4.28 ; also sheet 15
DCMI_D4 [dcmi]: J4.26 ; also sheet 15
DCMI_D5 [dcmi]: J4.33 ; also sheet 15
DCMI_D6 [dcmi]: J4.24 ; also sheet 15
DCMI_D7 [dcmi]: J4.22 ; also sheet 15
DCMI_FSIN: J4.23 Q5.3(D) R28.1
DCMI_HSYNC [dcmi]: J4.18 ; also sheet 15
DCMI_MISO [spi]: J4.15 ; also sheet 15
DCMI_MOSI [spi]: J4.17 ; also sheet 15
DCMI_PCLK [dcmi]: J4.14 ; also sheet 15
DCMI_PWDN: J4.25 R29.1 ; also sheet 15
DCMI_RST: J4.21 R27.1 ; also sheet 15
DCMI_SCL [i2c]: J4.32 R30.1 ; also sheet 15
DCMI_SCLK [spi]: J4.13 ; also sheet 15
DCMI_SDA [i2c]: J4.34 R31.1 ; also sheet 15
DCMI_SSEL [spi]: J4.11 R24.1 ; also sheet 15
DCMI_VSYNC [dcmi]: J4.16 ; also sheet 15
GND [gnd]: C32.2 C33.1 C39.1 C40.1 C42.1 C44.1 C51.2 C52.1 J4.5 J4.19 J4.27 R27.2 ; also sheet 1,2,3,4,5,6,7,8,9,11,12,13,14,15
P10_PWM: Q4.3(D) R26.1 ; also sheet 11
PWM_FSIN: Q4.2(S) Q5.2(S) R25.1 ; also sheet 15
VCC: C32.1 C33.2 C39.2 C40.2 C42.2 C44.2 J4.2 J4.10 J4.20 J4.30 J4.36 L4.2 Q4.1(G) Q5.1(G) R24.2 R25.2 R26.2 R28.2 R29.2 R30.2 R31.2 ; also sheet 3,5,6,7,8,9,11,12,13,14,15
VDDA: C51.1 C52.2 J4.4 L4.1
Unconnected: J4.1 J4.3 J4.6 J4.7 J4.8 J4.9

### Notes on the sheet
- IMAGE SENSOR CONNECTOR
- Copyright (c) 2013-2023 OpenMV <openmv@openmv.io>
- This work is licensed under the Creative Commons Attribution-ShareAlike 3.0 License.
- To view a copy of this license, visit http://creativecommons.org/licenses/by-sa/3.0/

## Sheet 11 of 15
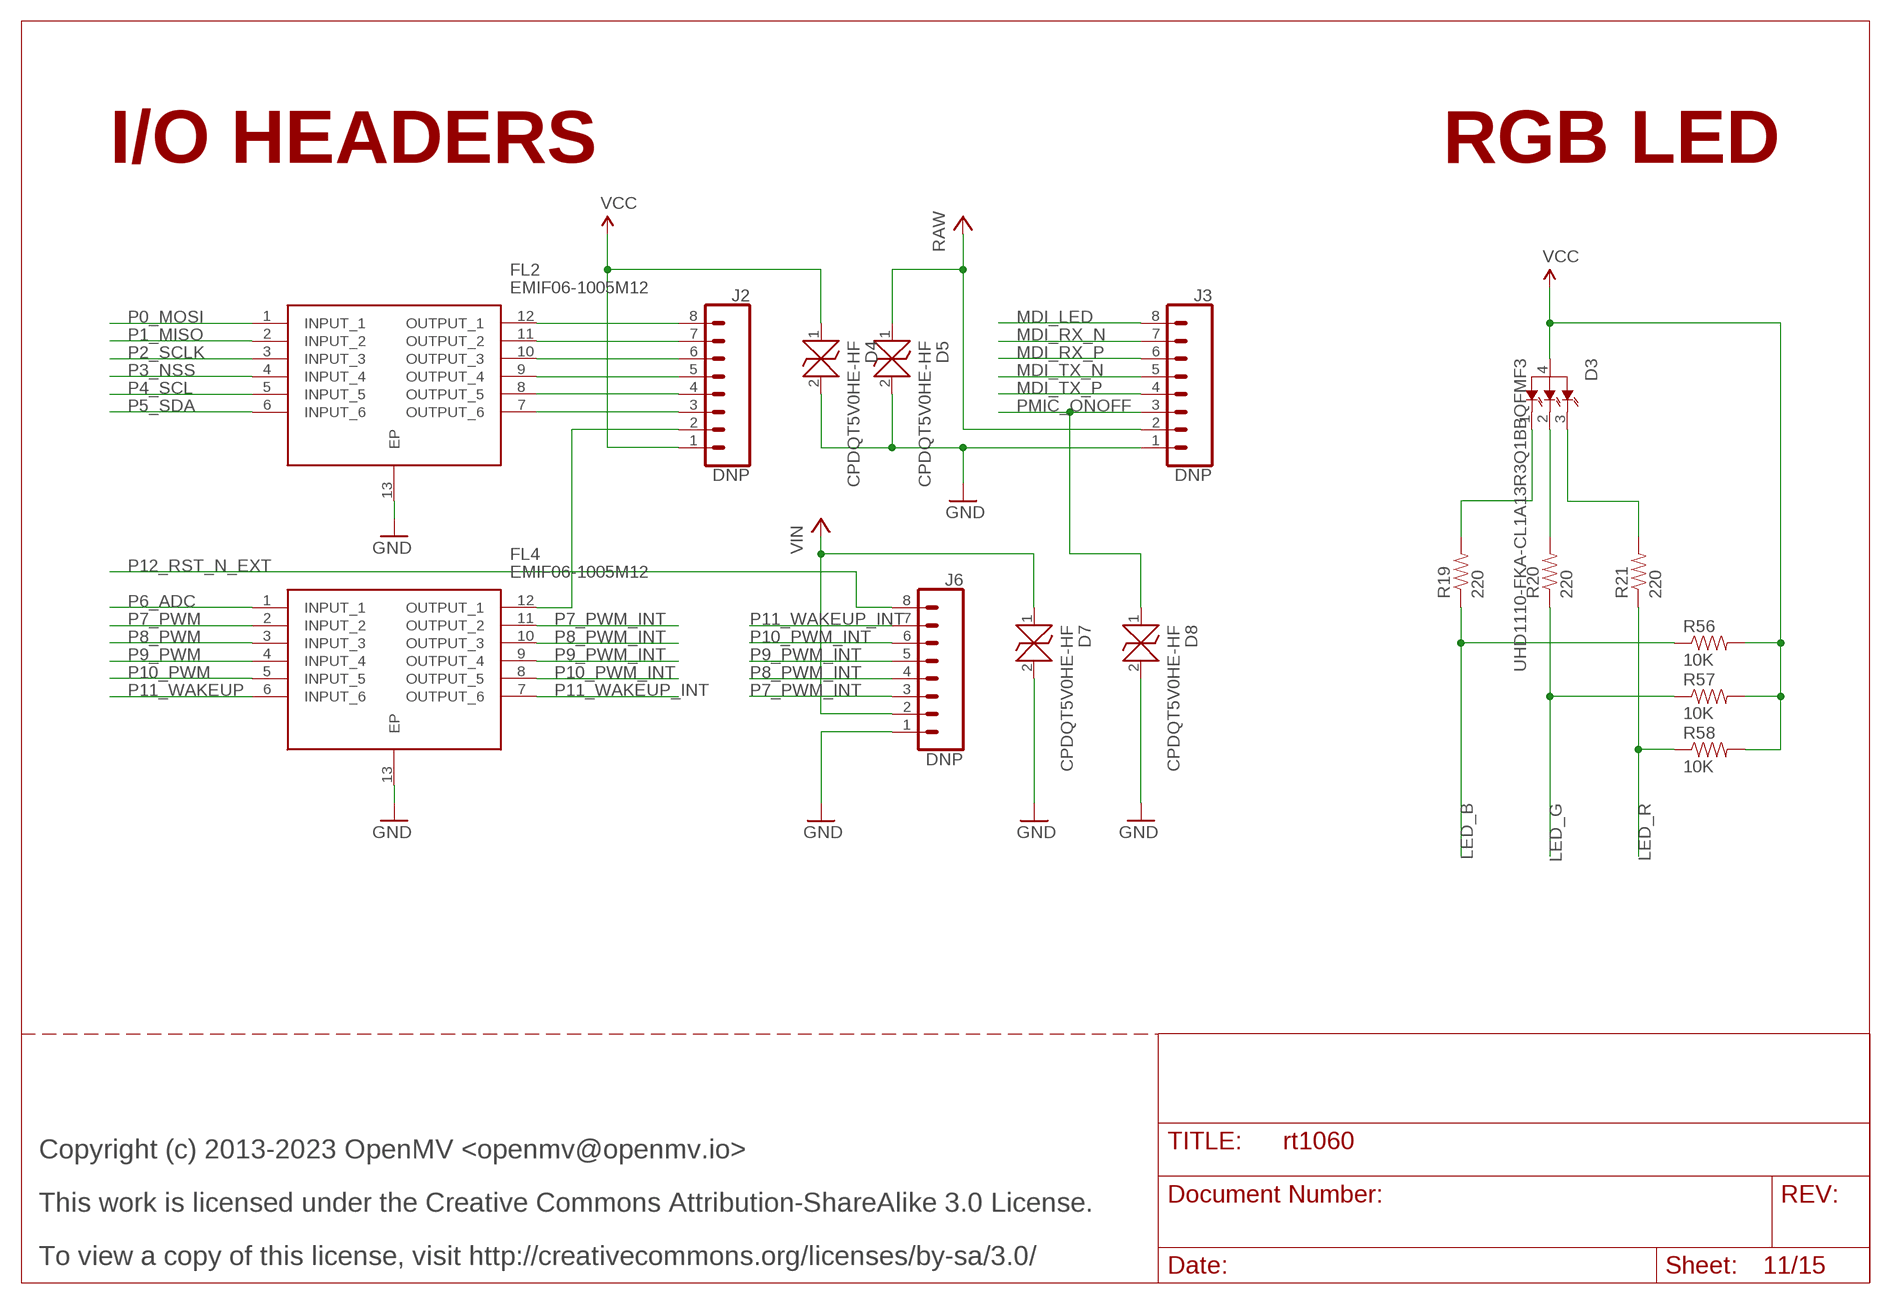
[diagram p10: schematic, sheet 11]

### Parts
D3  UHD1110-FKA-CL1A13R3Q1BBQFMF3  [LED_UHD1110-FKA-CL1A13R3Q1BBQFMF3]
D4  CPDQT5V0HE-HF  [CPDQT5V0HEHF]
D5  CPDQT5V0HE-HF  [CPDQT5V0HEHF]
D7  CPDQT5V0HE-HF  [CPDQT5V0HEHF]
D8  CPDQT5V0HE-HF  [CPDQT5V0HEHF]
FL2  EMIF06-1005M12  [SON40P150X250X65-13N]
FL4  EMIF06-1005M12  [SON40P150X250X65-13N]
J2  DNP  CONN_08"  [1X08]
J3  DNP  CONN_08"  [1X08]
J6  DNP  CONN_08"  [1X08]
R19  220  RESISTOR0402-RES  [0402-RES]
R20  220  RESISTOR0402-RES  [0402-RES]
R21  220  RESISTOR0402-RES  [0402-RES]
R56  10K  RES_0402  [0402]
R57  10K  RES_0402  [0402]
R58  10K  RES_0402  [0402]

### Nets
GND [gnd]: D4.2 D5.2 D7.2 D8.2 FL2.13(EP) FL4.13(EP) J3.1 J6.1 ; also sheet 1,2,3,4,5,6,7,8,9,10,12,13,14,15
LED_B: R19.1 R56.1 ; also sheet 15
LED_B_INT: D3.1(BLUE) R19.2
LED_G: R20.1 R57.1 ; also sheet 15
LED_G_INT: D3.2(GREEN) R20.2
LED_R: R21.1 R58.1 ; also sheet 15
LED_R_INT: D3.3(RED) R21.2
MDI_LED: J3.8 ; also sheet 13
MDI_RX_N [mdi]: J3.7 ; also sheet 13
MDI_RX_P [mdi]: J3.6 ; also sheet 13
MDI_TX_N [mdi]: J3.5 ; also sheet 13
MDI_TX_P [mdi]: J3.4 ; also sheet 13
P0_MOSI [spi]: FL2.1(INPUT_1) ; also sheet 15
P0_MOSI_INT [spi]: FL2.12(OUTPUT_1) J2.8
P1_MISO [spi]: FL2.2(INPUT_2) ; also sheet 15
P1_MISO_INT [spi]: FL2.11(OUTPUT_2) J2.7
P2_SCLK [spi]: FL2.3(INPUT_3) ; also sheet 15
P2_SCLK_INT [spi]: FL2.10(OUTPUT_3) J2.6
P3_NSS [spi]: FL2.4(INPUT_4) ; also sheet 15
P3_NSS_INT [spi]: FL2.9(OUTPUT_4) J2.5
P4_SCL [i2c]: FL2.5(INPUT_5) ; also sheet 15
P4_SCL_INT [i2c]: FL2.8(OUTPUT_5) J2.4
P5_SDA [i2c]: FL2.6(INPUT_6) ; also sheet 15
P5_SDA_INT [i2c]: FL2.7(OUTPUT_6) J2.3
P6_ADC: FL4.1(INPUT_1) ; also sheet 15
P6_ADC_INT: FL4.12(OUTPUT_1) J2.2
P7_PWM: FL4.2(INPUT_2) ; also sheet 15
P7_PWM_INT: FL4.11(OUTPUT_2) J6.3
P8_PWM: FL4.3(INPUT_3) ; also sheet 15
P8_PWM_INT: FL4.10(OUTPUT_3) J6.4
P9_PWM: FL4.4(INPUT_4) ; also sheet 15
P9_PWM_INT: FL4.9(OUTPUT_4) J6.5
P10_PWM: FL4.5(INPUT_5) ; also sheet 10
P10_PWM_INT: FL4.8(OUTPUT_5) J6.6
P11_WAKEUP: FL4.6(INPUT_6) ; also sheet 4
P11_WAKEUP_INT: FL4.7(OUTPUT_6) J6.7
P12_RST_N_EXT: J6.8 ; also sheet 12
PMIC_ONOFF: D8.1 J3.3 ; also sheet 4
RAW: D5.1 J3.2 ; also sheet 3,4,5
VCC: D3.4(ANODE) D4.1 J2.1 R56.2 R57.2 R58.2 ; also sheet 3,5,6,7,8,9,10,12,13,14,15
VIN [power]: D7.1 J6.2 ; also sheet 2

### Notes on the sheet
- I/O HEADERS | RGB LED
- Copyright (c) 2013-2023 OpenMV <openmv@openmv.io>
- This work is licensed under the Creative Commons Attribution-ShareAlike 3.0 License.
- To view a copy of this license, visit http://creativecommons.org/licenses/by-sa/3.0/

## Sheet 12 of 15
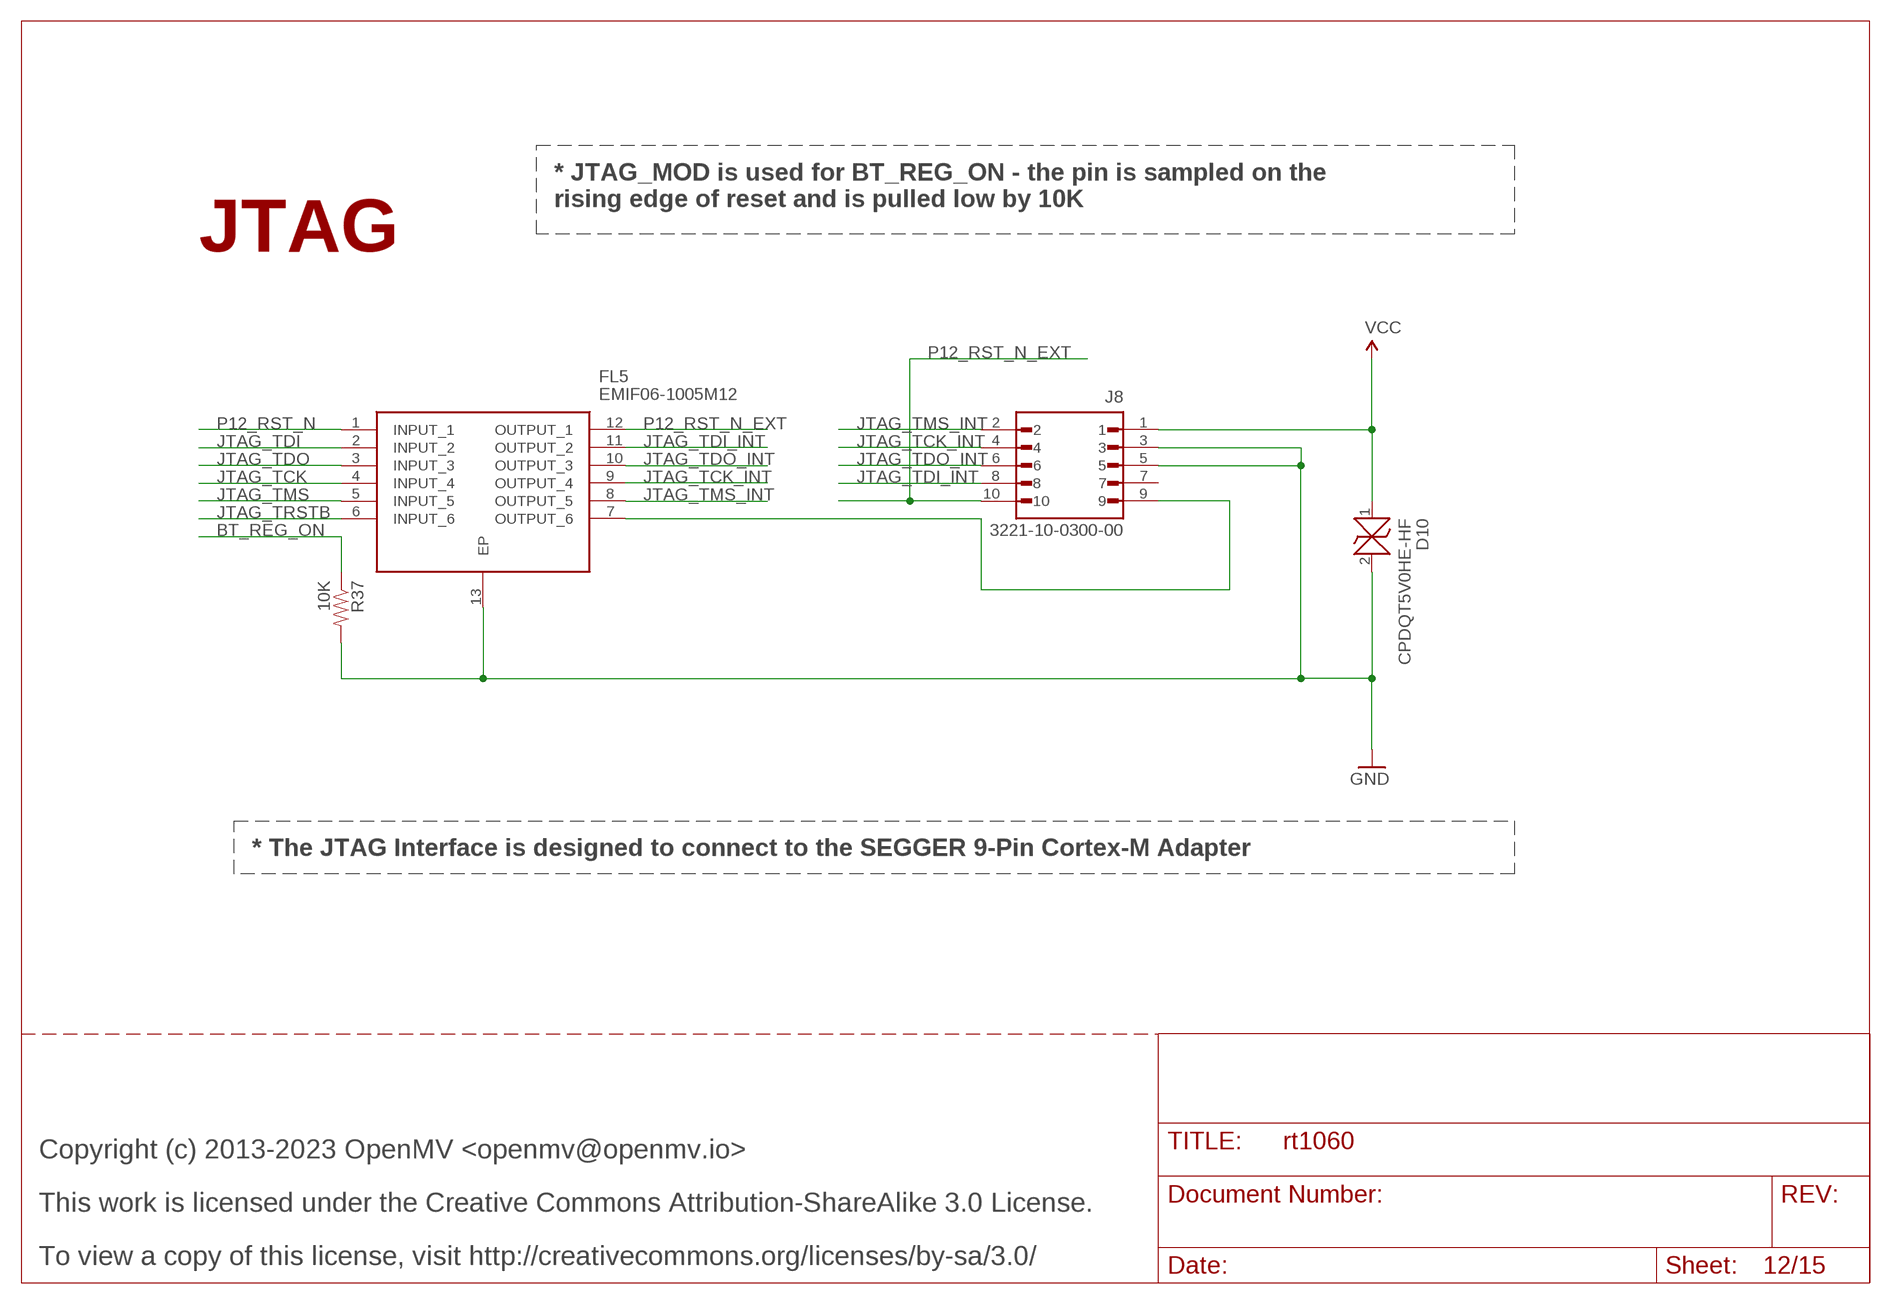
[diagram p11: schematic, sheet 12]

### Parts
D10  CPDQT5V0HE-HF  [CPDQT5V0HEHF]
FL5  EMIF06-1005M12  [SON40P150X250X65-13N]
J8  3221-10-0300-00  [CNC_3221-10-0300-00]
R37  10K  RESISTOR0402-RES  [0402-RES]

### Nets
BT_REG_ON: R37.1 ; also sheet 14,15
GND [gnd]: D10.2 FL5.13(EP) J8.3 J8.5 R37.2 ; also sheet 1,2,3,4,5,6,7,8,9,10,11,13,14,15
JTAG_TCK [jtag]: FL5.4(INPUT_4) ; also sheet 15
JTAG_TCK_INT [jtag]: FL5.9(OUTPUT_4) J8.4
JTAG_TDI [jtag]: FL5.2(INPUT_2) ; also sheet 15
JTAG_TDI_INT [jtag]: FL5.11(OUTPUT_2) J8.8
JTAG_TDO [jtag]: FL5.3(INPUT_3) ; also sheet 15
JTAG_TDO_INT [jtag]: FL5.10(OUTPUT_3) J8.6
JTAG_TMS [jtag]: FL5.5(INPUT_5) ; also sheet 15
JTAG_TMS_INT [jtag]: FL5.8(OUTPUT_5) J8.2
JTAG_TRSTB [jtag]: FL5.6(INPUT_6) ; also sheet 15
JTAG_TRSTB_INT [jtag]: FL5.7(OUTPUT_6) J8.9
P12_RST_N: FL5.1(INPUT_1) ; also sheet 15
P12_RST_N_EXT: FL5.12(OUTPUT_1) J8.10 ; also sheet 11
VCC: D10.1 J8.1 ; also sheet 3,5,6,7,8,9,10,11,13,14,15
Unconnected: J8.7

### Notes on the sheet
- * JTAG_MOD is used for BT_REG_ON - the pin is sampled on the
  rising edge of reset and is pulled low by 10K
- JTAG
- * The JTAG Interface is designed to connect to the SEGGER 9-Pin Cortex-M Adapter
- Copyright (c) 2013-2023 OpenMV <openmv@openmv.io>
- This work is licensed under the Creative Commons Attribution-ShareAlike 3.0 License.
- To view a copy of this license, visit http://creativecommons.org/licenses/by-sa/3.0/

## Sheet 13 of 15
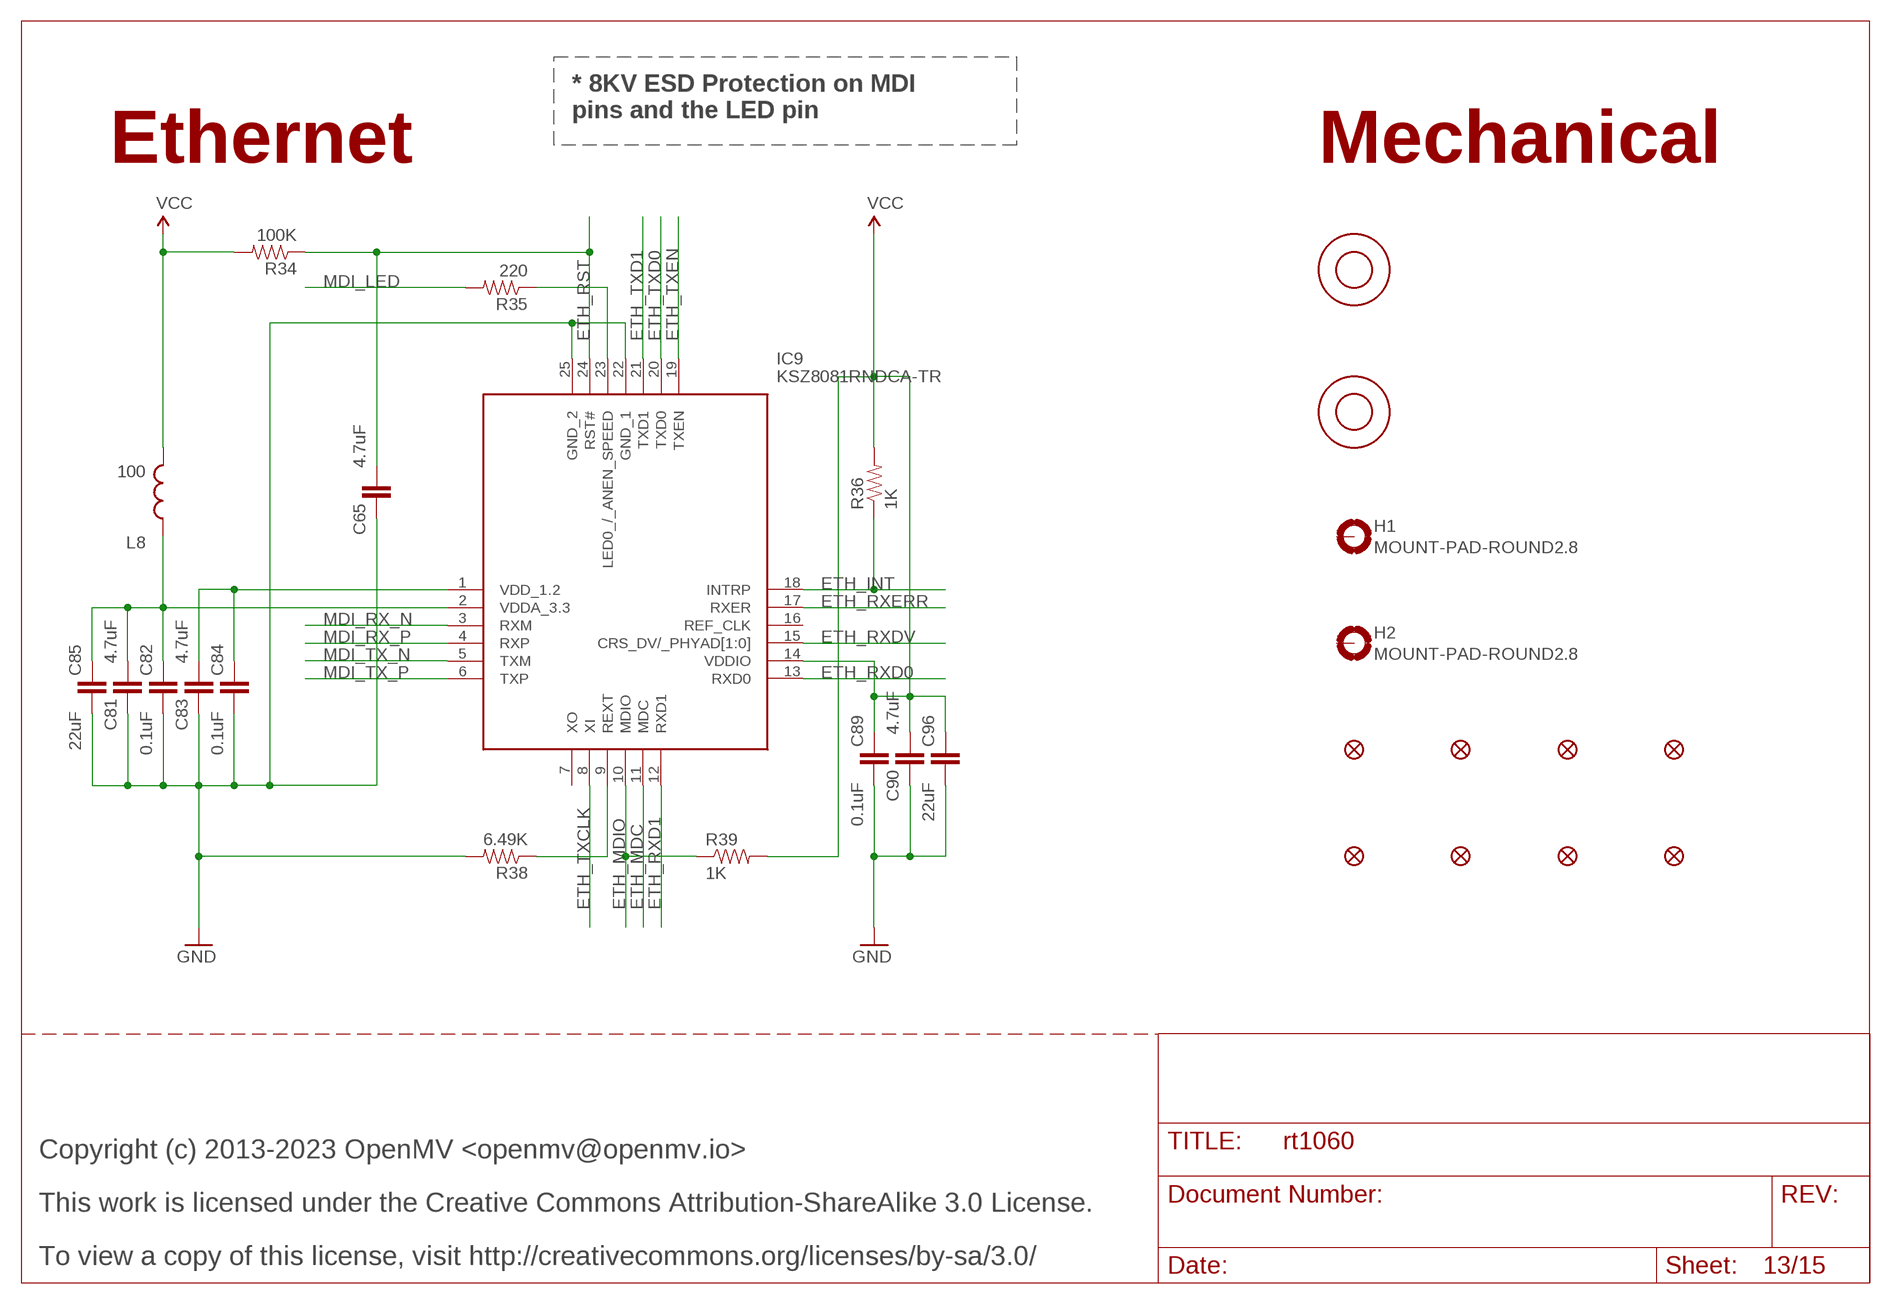
[diagram p12: schematic, sheet 13]

### Parts
C65  4.7uF  CAP0402-CAP  [0402-CAP]
C81  4.7uF  CAP0402-CAP  [0402-CAP]
C82  0.1uF  CAP_0402  [0402]
C83  4.7uF  CAP0402-CAP  [0402-CAP]
C84  0.1uF  CAP_0402  [0402]
C85  22uF  22UF-0805-6.3V-20%  [0805]
C89  0.1uF  CAP_0402  [0402]
C90  4.7uF  CAP0402-CAP  [0402-CAP]
C96  22uF  22UF-0805-6.3V-20%  [0805]
FD1  FIDUCIAL1X2  [FIDUCIAL-1X2]
FD2  FIDUCIAL1X2  [FIDUCIAL-1X2]
FD3  FIDUCIAL1X2  [FIDUCIAL-1X2]
FD4  FIDUCIAL1X2  [FIDUCIAL-1X2]
FD5  FIDUCIAL1X2  [FIDUCIAL-1X2]
FD6  FIDUCIAL1X2  [FIDUCIAL-1X2]
FD7  FIDUCIAL1X2  [FIDUCIAL-1X2]
FD8  FIDUCIAL1X2  [FIDUCIAL-1X2]
H1  MOUNT-PAD-ROUND2.8  [2,8-PAD]
H2  MOUNT-PAD-ROUND2.8  [2,8-PAD]
IC9  KSZ8081RNDCA-TR  [QFN50P400X400X90-25N]
L8  100  INDUCTOR0402  [C0402]
M1  9774030151R  [9774030151R]
M2  9774030151R  [9774030151R]
R34  100K  RESISTOR0402-RES  [0402-RES]
R35  220  RESISTOR0402-RES  [0402-RES]
R36  1K  RESISTOR0402-RES  [0402-RES]
R38  6.49K  RESISTOR0402-RES  [0402-RES]
R39  1K  RESISTOR0402-RES  [0402-RES]

### Nets
ETH_INT: IC9.18(INTRP) R36.1 ; also sheet 15
ETH_LED: IC9.23(LED0_/_ANEN_SPEED) R35.1
ETH_MDC [mdio]: IC9.11(MDC) ; also sheet 15
ETH_MDIO [mdio]: IC9.10(MDIO) R39.1 ; also sheet 15
ETH_RST: C65.2 IC9.24(RST#) R34.1 ; also sheet 15
ETH_RXD0 [eth]: IC9.13(RXD0) ; also sheet 15
ETH_RXD1 [eth]: IC9.12(RXD1) ; also sheet 15
ETH_RXDV [eth]: IC9.15(CRS_DV/_PHYAD[1:0]) ; also sheet 15
ETH_RXERR [eth]: IC9.17(RXER) ; also sheet 15
ETH_TXCLK [eth]: IC9.8(XI) ; also sheet 15
ETH_TXD0 [eth]: IC9.20(TXD0) ; also sheet 15
ETH_TXD1 [eth]: IC9.21(TXD1) ; also sheet 15
ETH_TXEN [eth]: IC9.19(TXEN) ; also sheet 15
ETH_VDD_1.2: C83.2 C84.1 IC9.1(VDD_1.2)
ETH_VDDA_3.3: C81.2 C82.1 C85.1 IC9.2(VDDA_3.3) L8.1
GND [gnd]: C65.1 C81.1 C82.2 C83.1 C84.2 C85.2 C89.2 C90.1 C96.2 IC9.22(GND_1) IC9.25(GND_2) R38.2 ; also sheet 1,2,3,4,5,6,7,8,9,10,11,12,14,15
MDI_LED: R35.2 ; also sheet 11
MDI_RX_N [mdi]: IC9.3(RXM) ; also sheet 11
MDI_RX_P [mdi]: IC9.4(RXP) ; also sheet 11
MDI_TX_N [mdi]: IC9.5(TXM) ; also sheet 11
MDI_TX_P [mdi]: IC9.6(TXP) ; also sheet 11
REXT: IC9.9(REXT) R38.1
VCC: C89.1 C90.2 C96.1 IC9.14(VDDIO) L8.2 R34.2 R36.2 R39.2 ; also sheet 3,5,6,7,8,9,10,11,12,14,15
Unconnected: H1.B2,8(MOUNT) H2.B2,8(MOUNT) IC9.7(XO) IC9.16(REF_CLK)

### Notes on the sheet
- * 8KV ESD Protection on MDI
  pins and the LED pin
- Ethernet | Mechanical
- Copyright (c) 2013-2023 OpenMV <openmv@openmv.io>
- This work is licensed under the Creative Commons Attribution-ShareAlike 3.0 License.
- To view a copy of this license, visit http://creativecommons.org/licenses/by-sa/3.0/

## Sheet 14 of 15
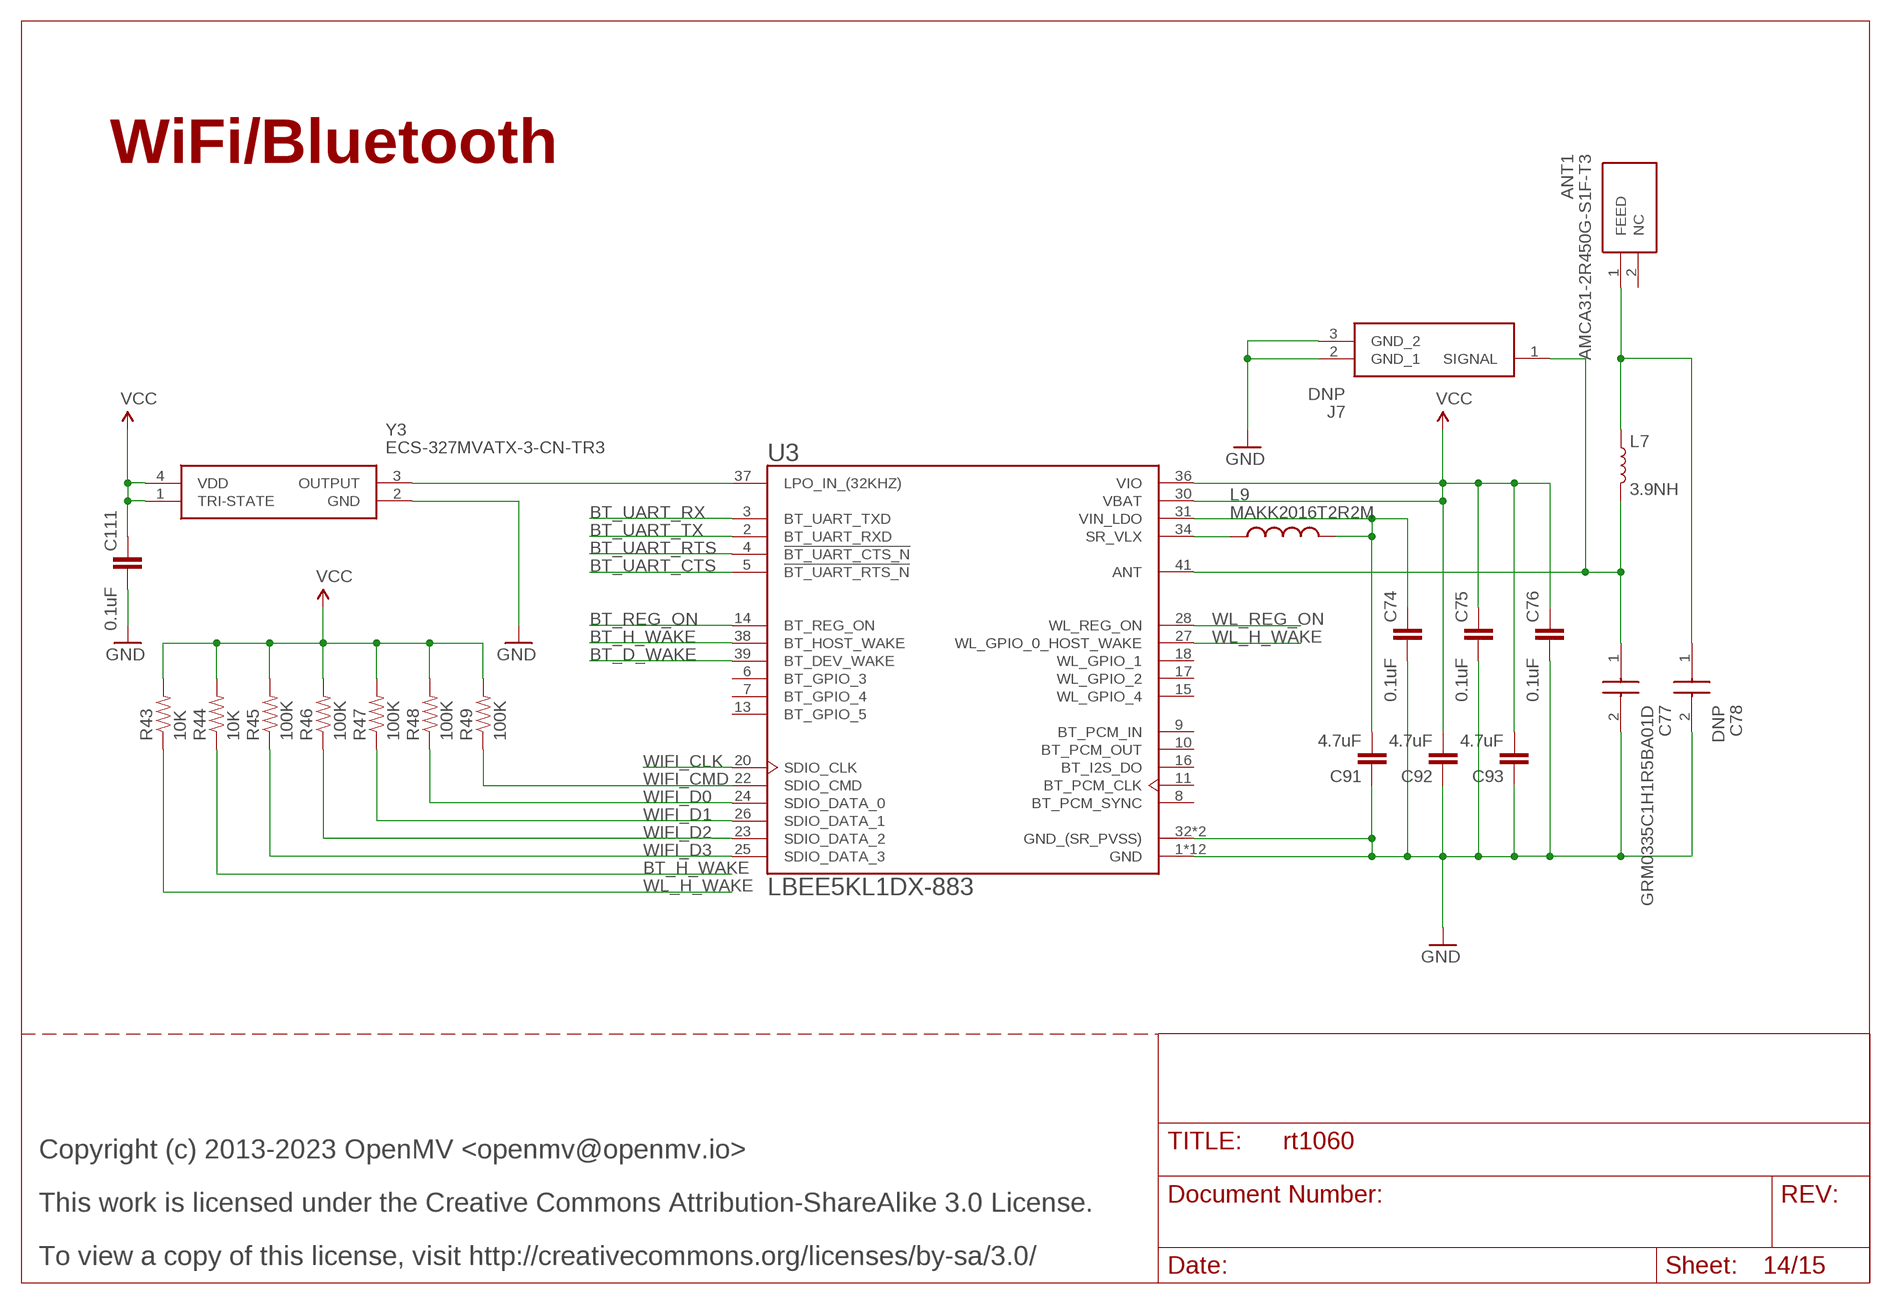
[diagram p13: schematic, sheet 14]

### Parts
ANT1  AMCA31-2R450G-S1F-T3  [ANTC3216X140N]
C74  0.1uF  CAP_0402  [0402]
C75  0.1uF  CAP_0402  [0402]
C76  0.1uF  CAP_0402  [0402]
C77  GRM0335C1H1R5BA01D  [CAPC0603X33N]
C78  DNP  GRM0335C1H1R5BA01D  [CAPC0603X33N]
C91  4.7uF  CAP0402-CAP  [0402-CAP]
C92  4.7uF  CAP0402-CAP  [0402-CAP]
C93  4.7uF  CAP0402-CAP  [0402-CAP]
C111  0.1uF  CAP_0402  [0402]
J7  DNP  2337019-1  [23370191]
L7  3.9NH  INDUCTOR-0402-3.9NH  [0402]
L9  MAKK2016T2R2M  [INDC2016X100N]
R43  10K  RES_0402  [0402]
R44  10K  RES_0402  [0402]
R45  100K  RES_0402  [0402]
R46  100K  RES_0402  [0402]
R47  100K  RES_0402  [0402]
R48  100K  RES_0402  [0402]
R49  100K  RES_0402  [0402]
U3  LBEE5KL1DX-883  LBEE5KL1DX-TEMP  [XCVR_LBEE5KL1DX-TEMP]
Y3  ECS-327MVATX-3-CN-TR3  [ECS327MVATX3CNTR3]

### Nets
ANT: C77.1 J7.1(SIGNAL) L7.2 U3.41(ANT)
BT_D_WAKE: U3.39(BT_DEV_WAKE) ; also sheet 15
BT_H_WAKE: R44.1 U3.38(BT_HOST_WAKE) ; also sheet 15
BT_REG_ON: U3.14(BT_REG_ON) ; also sheet 12,15
BT_UART_CTS: U3.5(!BT_UART_RTS_N) ; also sheet 15
BT_UART_RTS: U3.4(!BT_UART_CTS_N) ; also sheet 15
BT_UART_RX: U3.3(BT_UART_TXD) ; also sheet 15
BT_UART_TX: U3.2(BT_UART_RXD) ; also sheet 15
FEED: ANT1.1(FEED) C78.1 L7.1
GND [gnd]: C74.2 C75.2 C76.2 C77.2 C78.2 C91.1 C92.1 C93.1 C111.2 J7.2(GND_1) J7.3(GND_2) U3.1(GND) U3.12(GND) U3.19(GND) U3.21(GND) U3.29(GND) U3.32(GND_(SR_PVSS)) U3.33(GND_(SR_PVSS)) U3.35(GND) U3.40(GND) U3.42(GND) U3.43(GND) U3.44(GND) U3.45(GND) U3.46(GND) Y3.2(GND) ; also sheet 1,2,3,4,5,6,7,8,9,10,11,12,13,15
LPO_IN: U3.37(LPO_IN_(32KHZ)) Y3.3(OUTPUT)
SR_VLX: L9.1 U3.34(SR_VLX)
VCC: C75.1 C76.1 C92.2 C93.2 C111.1 R43.2 R44.2 R45.2 R46.2 R47.2 R48.2 R49.2 U3.30(VBAT) U3.36(VIO) Y3.1(TRI-STATE) Y3.4(VDD) ; also sheet 3,5,6,7,8,9,10,11,12,13,15
VIN_LDO: C74.1 C91.2 L9.2 U3.31(VIN_LDO)
WIFI_CLK [wifi]: U3.20(SDIO_CLK) ; also sheet 15
WIFI_CMD [wifi]: R49.1 U3.22(SDIO_CMD) ; also sheet 15
WIFI_D0 [wifi]: R48.1 U3.24(SDIO_DATA_0) ; also sheet 15
WIFI_D1 [wifi]: R47.1 U3.26(SDIO_DATA_1) ; also sheet 15
WIFI_D2 [wifi]: R46.1 U3.23(SDIO_DATA_2) ; also sheet 15
WIFI_D3 [wifi]: R45.1 U3.25(SDIO_DATA_3) ; also sheet 15
WL_H_WAKE: R43.1 U3.27(WL_GPIO_0_HOST_WAKE) ; also sheet 15
WL_REG_ON: U3.28(WL_REG_ON) ; also sheet 15
Unconnected: ANT1.2(NC) U3.6(BT_GPIO_3) U3.7(BT_GPIO_4) U3.8(BT_PCM_SYNC) U3.9(BT_PCM_IN) U3.10(BT_PCM_OUT) U3.11(BT_PCM_CLK) U3.13(BT_GPIO_5) U3.15(WL_GPIO_4) U3.16(BT_I2S_DO) U3.17(WL_GPIO_2) U3.18(WL_GPIO_1)

### Notes on the sheet
- WiFi/Bluetooth
- Copyright (c) 2013-2023 OpenMV <openmv@openmv.io>
- This work is licensed under the Creative Commons Attribution-ShareAlike 3.0 License.
- To view a copy of this license, visit http://creativecommons.org/licenses/by-sa/3.0/

## Sheet 15 of 15
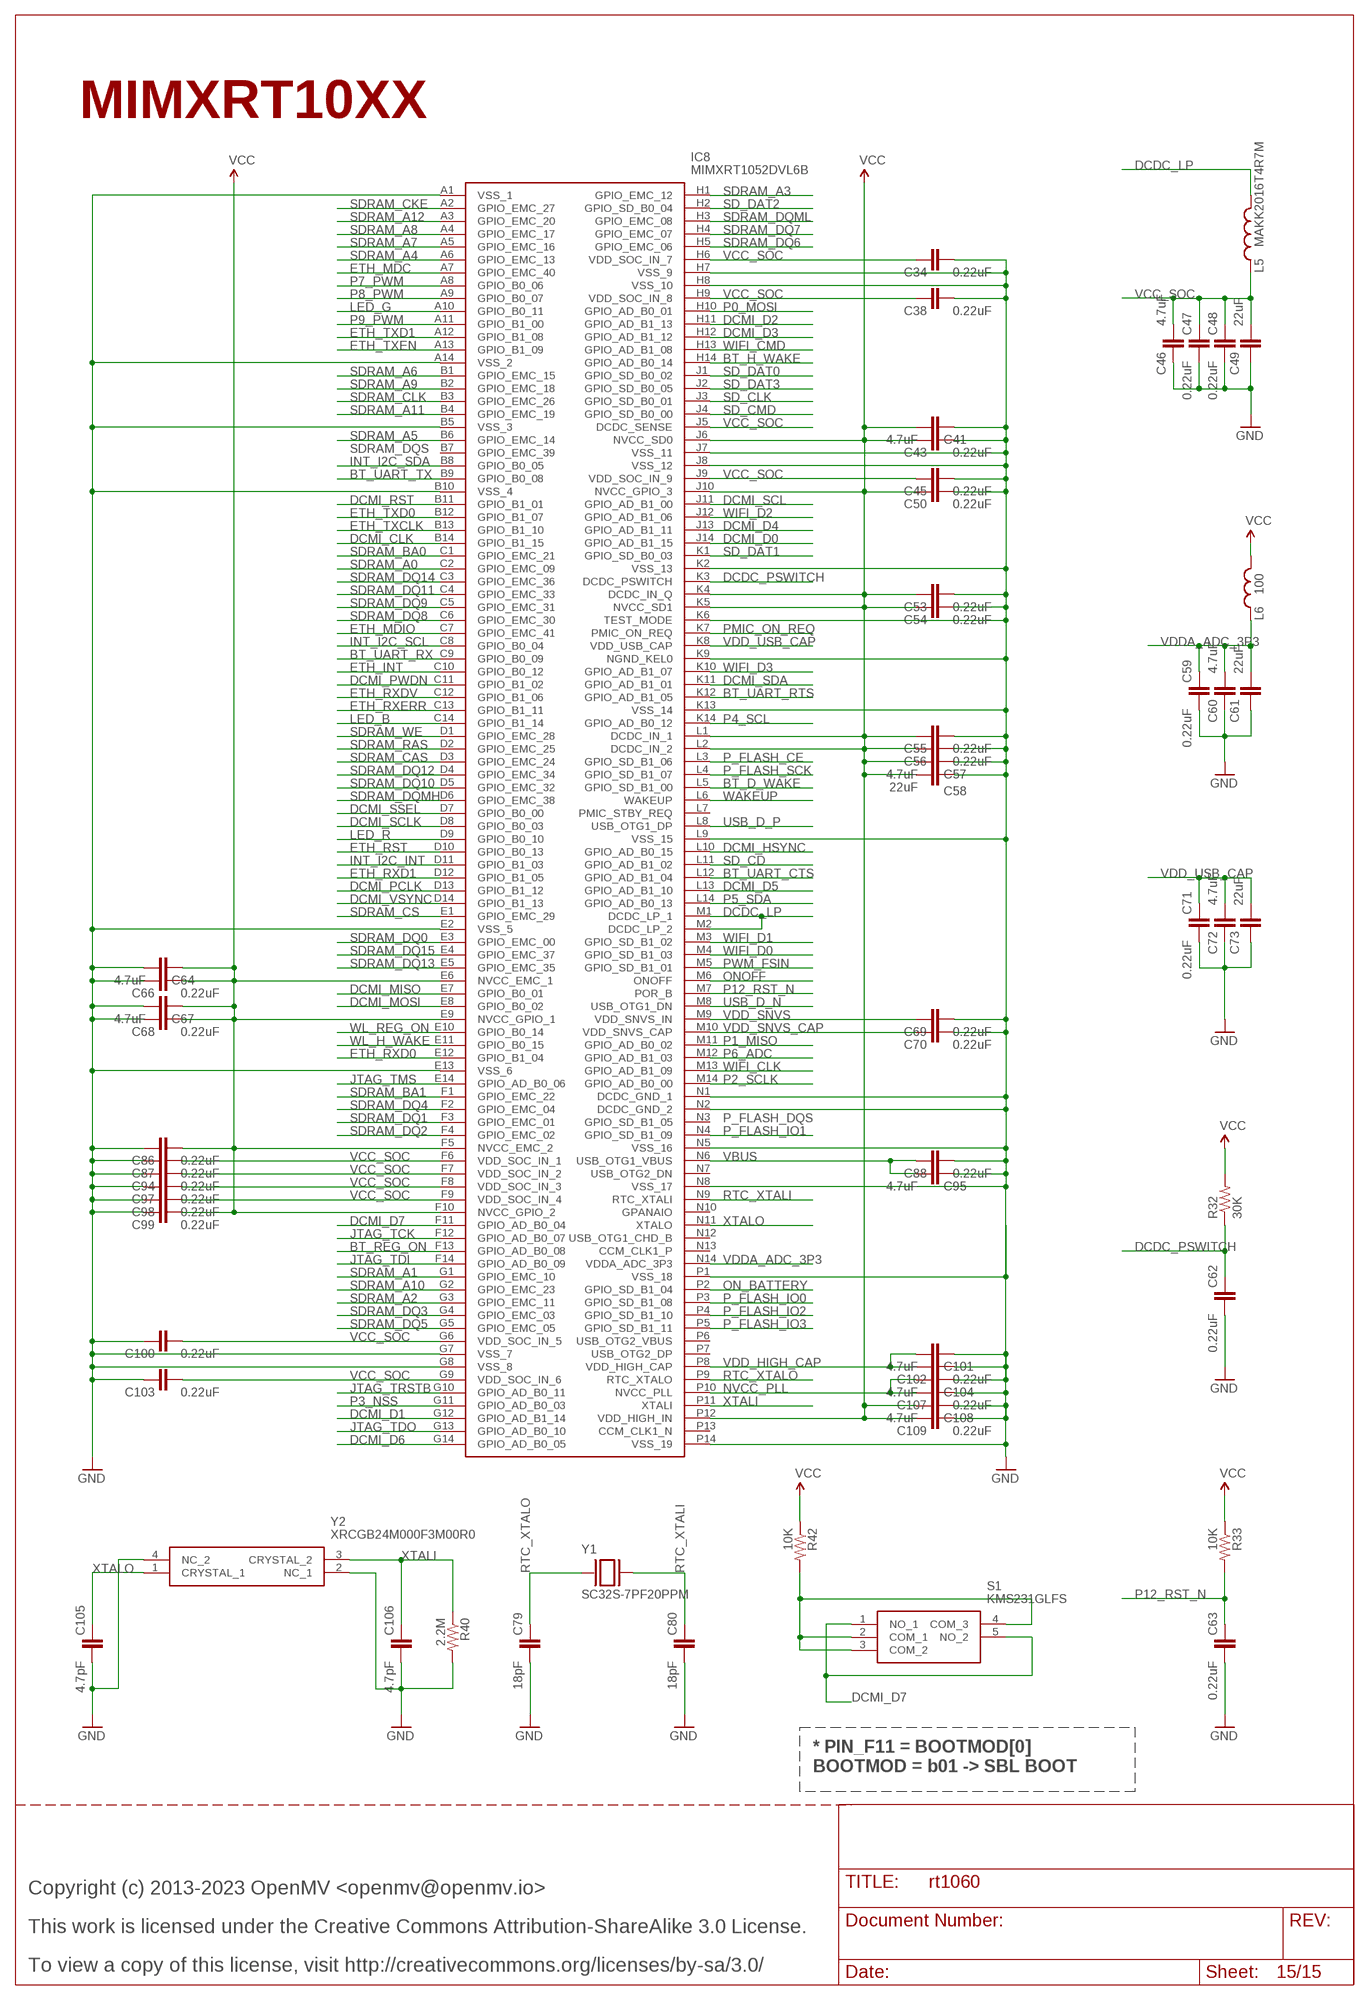
[diagram p14: schematic, sheet 15]

### Parts
C34  0.22uF  C-EUC0201  [C0201]
C38  0.22uF  C-EUC0201  [C0201]
C41  4.7uF  CAP0402-CAP  [0402-CAP]
C43  0.22uF  C-EUC0201  [C0201]
C45  0.22uF  C-EUC0201  [C0201]
C46  4.7uF  CAP0402-CAP  [0402-CAP]
C47  0.22uF  C-EUC0201  [C0201]
C48  0.22uF  C-EUC0201  [C0201]
C49  22uF  22UF-0805-6.3V-20%  [0805]
C50  0.22uF  C-EUC0201  [C0201]
C53  0.22uF  C-EUC0201  [C0201]
C54  0.22uF  C-EUC0201  [C0201]
C55  0.22uF  C-EUC0201  [C0201]
C56  0.22uF  C-EUC0201  [C0201]
C57  4.7uF  CAP0402-CAP  [0402-CAP]
C58  22uF  22UF-0805-6.3V-20%  [0805]
C59  0.22uF  C-EUC0201  [C0201]
C60  4.7uF  CAP0402-CAP  [0402-CAP]
C61  22uF  22UF-0805-6.3V-20%  [0805]
C62  0.22uF  C-EUC0201  [C0201]
C63  0.22uF  C-EUC0201  [C0201]
C64  4.7uF  CAP0402-CAP  [0402-CAP]
C66  0.22uF  C-EUC0201  [C0201]
C67  4.7uF  CAP0402-CAP  [0402-CAP]
C68  0.22uF  C-EUC0201  [C0201]
C69  0.22uF  C-EUC0201  [C0201]
C70  0.22uF  C-EUC0201  [C0201]
C71  0.22uF  C-EUC0201  [C0201]
C72  4.7uF  CAP0402-CAP  [0402-CAP]
C73  22uF  22UF-0805-6.3V-20%  [0805]
C79  18pF  C-EUC0201  [C0201]
C80  18pF  C-EUC0201  [C0201]
C86  0.22uF  C-EUC0201  [C0201]
C87  0.22uF  C-EUC0201  [C0201]
C88  0.22uF  C-EUC0201  [C0201]
C94  0.22uF  C-EUC0201  [C0201]
C95  4.7uF  CAP0402-CAP  [0402-CAP]
C97  0.22uF  C-EUC0201  [C0201]
C98  0.22uF  C-EUC0201  [C0201]
C99  0.22uF  C-EUC0201  [C0201]
C100  0.22uF  C-EUC0201  [C0201]
C101  4.7uF  CAP0402-CAP  [0402-CAP]
C102  0.22uF  C-EUC0201  [C0201]
C103  0.22uF  C-EUC0201  [C0201]
C104  4.7uF  CAP0402-CAP  [0402-CAP]
C105  4.7pF  C-EUC0201  [C0201]
C106  4.7pF  C-EUC0201  [C0201]
C107  0.22uF  C-EUC0201  [C0201]
C108  4.7uF  CAP0402-CAP  [0402-CAP]
C109  0.22uF  C-EUC0201  [C0201]
IC8  MIMXRT1052DVL6B  [BGA196C65P14X14_1000X1000X143]
L5  MAKK2016T4R7M  [INDC2016X100N]
L6  100  INDUCTOR0402  [C0402]
R32  30K  RESISTOR0402-RES  [0402-RES]
R33  10K  RESISTOR0402-RES  [0402-RES]
R40  2.2M  RESISTOR0402-RES  [0402-RES]
R42  10K  RESISTOR0402-RES  [0402-RES]
S1  KMS231GLFS  [KMS231GLFS]
Y1  SC32S-7PF20PPM  ABS07-32.768KHZ-7-T  [XTAL_ABS07-32.768KHZ-7-T]
Y2  XRCGB24M000F3M00R0  [XRCGB24M000F3M00R0]

### Nets
BT_D_WAKE: IC8.L5(GPIO_SD_B1_00) ; also sheet 14
BT_H_WAKE: IC8.H14(GPIO_AD_B0_14) ; also sheet 14
BT_REG_ON: IC8.F13(GPIO_AD_B0_08) ; also sheet 12,14
BT_UART_CTS: IC8.L12(GPIO_AD_B1_04) ; also sheet 14
BT_UART_RTS: IC8.K12(GPIO_AD_B1_05) ; also sheet 14
BT_UART_RX: IC8.C9(GPIO_B0_09) ; also sheet 14
BT_UART_TX: IC8.B9(GPIO_B0_08) ; also sheet 14
DCDC_LP: IC8.M1(DCDC_LP_1) IC8.M2(DCDC_LP_2) L5.2
DCDC_PSWITCH: C62.1 IC8.K3(DCDC_PSWITCH) R32.1
DCMI_CLK: IC8.B14(GPIO_B1_15) ; also sheet 10
DCMI_D0 [dcmi]: IC8.J14(GPIO_AD_B1_15) ; also sheet 10
DCMI_D1 [dcmi]: IC8.G12(GPIO_AD_B1_14) ; also sheet 10
DCMI_D2 [dcmi]: IC8.H11(GPIO_AD_B1_13) ; also sheet 10
DCMI_D3 [dcmi]: IC8.H12(GPIO_AD_B1_12) ; also sheet 10
DCMI_D4 [dcmi]: IC8.J13(GPIO_AD_B1_11) ; also sheet 10
DCMI_D5 [dcmi]: IC8.L13(GPIO_AD_B1_10) ; also sheet 10
DCMI_D6 [dcmi]: IC8.G14(GPIO_AD_B0_05) ; also sheet 10
DCMI_D7 [dcmi]: IC8.F11(GPIO_AD_B0_04) S1.1(NO_1) S1.5(NO_2) ; also sheet 10
DCMI_HSYNC [dcmi]: IC8.L10(GPIO_AD_B0_15) ; also sheet 10
DCMI_MISO [spi]: IC8.E7(GPIO_B0_01) ; also sheet 10
DCMI_MOSI [spi]: IC8.E8(GPIO_B0_02) ; also sheet 10
DCMI_PCLK [dcmi]: IC8.D13(GPIO_B1_12) ; also sheet 10
DCMI_PWDN: IC8.C11(GPIO_B1_02) ; also sheet 10
DCMI_RST: IC8.B11(GPIO_B1_01) ; also sheet 10
DCMI_SCL [i2c]: IC8.J11(GPIO_AD_B1_00) ; also sheet 10
DCMI_SCLK [spi]: IC8.D8(GPIO_B0_03) ; also sheet 10
DCMI_SDA [i2c]: IC8.K11(GPIO_AD_B1_01) ; also sheet 10
DCMI_SSEL [spi]: IC8.D7(GPIO_B0_00) ; also sheet 10
DCMI_VSYNC [dcmi]: IC8.D14(GPIO_B1_13) ; also sheet 10
ETH_INT: IC8.C10(GPIO_B0_12) ; also sheet 13
ETH_MDC [mdio]: IC8.A7(GPIO_EMC_40) ; also sheet 13
ETH_MDIO [mdio]: IC8.C7(GPIO_EMC_41) ; also sheet 13
ETH_RST: IC8.D10(GPIO_B0_13) ; also sheet 13
ETH_RXD0 [eth]: IC8.E12(GPIO_B1_04) ; also sheet 13
ETH_RXD1 [eth]: IC8.D12(GPIO_B1_05) ; also sheet 13
ETH_RXDV [eth]: IC8.C12(GPIO_B1_06) ; also sheet 13
ETH_RXERR [eth]: IC8.C13(GPIO_B1_11) ; also sheet 13
ETH_TXCLK [eth]: IC8.B13(GPIO_B1_10) ; also sheet 13
ETH_TXD0 [eth]: IC8.B12(GPIO_B1_07) ; also sheet 13
ETH_TXD1 [eth]: IC8.A12(GPIO_B1_08) ; also sheet 13
ETH_TXEN [eth]: IC8.A13(GPIO_B1_09) ; also sheet 13
GND [gnd]: C34.2 C38.2 C41.1 C43.2 C45.2 C46.1 C47.2 C48.2 C49.1 C50.2 C53.2 C54.2 C55.2 C56.2 C57.1 C58.1 C59.2 C60.1 C61.1 C62.2 C63.2 C64.2 C66.1 C67.2 C68.1 C69.2 C70.2 C71.2 C72.1 C73.1 C79.2 C80.2 C86.1 C87.1 C88.2 C94.1 C95.1 C97.1 C98.1 C99.1 C100.1 C101.1 C102.2 C103.1 C104.1 C105.2 C106.2 C107.2 C108.1 C109.2 IC8.A1(VSS_1) IC8.A14(VSS_2) IC8.B5(VSS_3) IC8.B10(VSS_4) IC8.E2(VSS_5) IC8.E13(VSS_6) IC8.G7(VSS_7) IC8.G8(VSS_8) IC8.H7(VSS_9) IC8.H8(VSS_10) IC8.J7(VSS_11) IC8.J8(VSS_12) IC8.K2(VSS_13) IC8.K6(TEST_MODE) IC8.K9(NGND_KEL0) IC8.K13(VSS_14) IC8.L9(VSS_15) IC8.N1(DCDC_GND_1) IC8.N2(DCDC_GND_2) IC8.N5(VSS_16) IC8.N8(VSS_17) IC8.P1(VSS_18) IC8.P14(VSS_19) R40.2 Y2.2(NC_1) Y2.4(NC_2) ; also sheet 1,2,3,4,5,6,7,8,9,10,11,12,13,14
INT_I2C_INT: IC8.D11(GPIO_B1_03) ; also sheet 8
INT_I2C_SCL [i2c]: IC8.C8(GPIO_B0_04) ; also sheet 8
INT_I2C_SDA [i2c]: IC8.B8(GPIO_B0_05) ; also sheet 8
JTAG_TCK [jtag]: IC8.F12(GPIO_AD_B0_07) ; also sheet 12
JTAG_TDI [jtag]: IC8.F14(GPIO_AD_B0_09) ; also sheet 12
JTAG_TDO [jtag]: IC8.G13(GPIO_AD_B0_10) ; also sheet 12
JTAG_TMS [jtag]: IC8.E14(GPIO_AD_B0_06) ; also sheet 12
JTAG_TRSTB [jtag]: IC8.G10(GPIO_AD_B0_11) ; also sheet 12
LED_B: IC8.C14(GPIO_B1_14) ; also sheet 11
LED_G: IC8.A10(GPIO_B0_11) ; also sheet 11
LED_R: IC8.D9(GPIO_B0_10) ; also sheet 11
NVCC_PLL: C104.2 C107.1 IC8.P10(NVCC_PLL)
ON_BATTERY: IC8.P2(GPIO_SD_B1_04) ; also sheet 3
ONOFF: IC8.M6(ONOFF) ; also sheet 4
P0_MOSI [spi]: IC8.H10(GPIO_AD_B0_01) ; also sheet 11
P1_MISO [spi]: IC8.M11(GPIO_AD_B0_02) ; also sheet 11
P2_SCLK [spi]: IC8.M14(GPIO_AD_B0_00) ; also sheet 11
P3_NSS [spi]: IC8.G11(GPIO_AD_B0_03) ; also sheet 11
P4_SCL [i2c]: IC8.K14(GPIO_AD_B0_12) ; also sheet 11
P5_SDA [i2c]: IC8.L14(GPIO_AD_B0_13) ; also sheet 11
P6_ADC: IC8.M12(GPIO_AD_B1_03) ; also sheet 11
P7_PWM: IC8.A8(GPIO_B0_06) ; also sheet 11
P8_PWM: IC8.A9(GPIO_B0_07) ; also sheet 11
P9_PWM: IC8.A11(GPIO_B1_00) ; also sheet 11
P12_RST_N: C63.1 IC8.M7(POR_B) R33.2 ; also sheet 12
P_FLASH_CE [flash]: IC8.L3(GPIO_SD_B1_06) ; also sheet 7
P_FLASH_IO0 [flash]: IC8.P3(GPIO_SD_B1_08) ; also sheet 7
P_FLASH_IO1 [flash]: IC8.N4(GPIO_SD_B1_09) ; also sheet 7
P_FLASH_IO2 [flash]: IC8.P4(GPIO_SD_B1_10) ; also sheet 7
P_FLASH_IO3 [flash]: IC8.P5(GPIO_SD_B1_11) ; also sheet 7
P_FLASH_SCK [flash]: IC8.L4(GPIO_SD_B1_07) ; also sheet 7
PMIC_ON_REQ: IC8.K7(PMIC_ON_REQ) ; also sheet 5
PWM_FSIN: IC8.M5(GPIO_SD_B1_01) ; also sheet 10
RTC_XTALI: C80.1 IC8.N9(RTC_XTALI) Y1.2
RTC_XTALO: C79.1 IC8.P9(RTC_XTALO) Y1.1
SBL_BOOT: R42.2 S1.2(COM_1) S1.3(COM_2) S1.4(COM_3)
SD_CD: IC8.L11(GPIO_AD_B1_02) ; also sheet 9
SD_CLK [sdcard]: IC8.J3(GPIO_SD_B0_01) ; also sheet 9
SD_CMD [sdcard]: IC8.J4(GPIO_SD_B0_00) ; also sheet 9
SD_DAT0 [sdcard]: IC8.J1(GPIO_SD_B0_02) ; also sheet 9
SD_DAT1 [sdcard]: IC8.K1(GPIO_SD_B0_03) ; also sheet 9
SD_DAT2 [sdcard]: IC8.H2(GPIO_SD_B0_04) ; also sheet 9
SD_DAT3 [sdcard]: IC8.J2(GPIO_SD_B0_05) ; also sheet 9
SDRAM_A0 [sdram]: IC8.C2(GPIO_EMC_09) ; also sheet 6
SDRAM_A1 [sdram]: IC8.G1(GPIO_EMC_10) ; also sheet 6
SDRAM_A2 [sdram]: IC8.G3(GPIO_EMC_11) ; also sheet 6
SDRAM_A3 [sdram]: IC8.H1(GPIO_EMC_12) ; also sheet 6
SDRAM_A4 [sdram]: IC8.A6(GPIO_EMC_13) ; also sheet 6
SDRAM_A5 [sdram]: IC8.B6(GPIO_EMC_14) ; also sheet 6
SDRAM_A6 [sdram]: IC8.B1(GPIO_EMC_15) ; also sheet 6
SDRAM_A7 [sdram]: IC8.A5(GPIO_EMC_16) ; also sheet 6
SDRAM_A8 [sdram]: IC8.A4(GPIO_EMC_17) ; also sheet 6
SDRAM_A9 [sdram]: IC8.B2(GPIO_EMC_18) ; also sheet 6
SDRAM_A10 [sdram]: IC8.G2(GPIO_EMC_23) ; also sheet 6
SDRAM_A11 [sdram]: IC8.B4(GPIO_EMC_19) ; also sheet 6
SDRAM_A12 [sdram]: IC8.A3(GPIO_EMC_20) ; also sheet 6
SDRAM_BA0 [sdram]: IC8.C1(GPIO_EMC_21) ; also sheet 6
SDRAM_BA1 [sdram]: IC8.F1(GPIO_EMC_22) ; also sheet 6
SDRAM_CAS [sdram]: IC8.D3(GPIO_EMC_24) ; also sheet 6
SDRAM_CKE [sdram]: IC8.A2(GPIO_EMC_27) ; also sheet 6
SDRAM_CLK [sdram]: IC8.B3(GPIO_EMC_26) ; also sheet 6
SDRAM_CS [sdram]: IC8.E1(GPIO_EMC_29) ; also sheet 6
SDRAM_DQ0 [sdram]: IC8.E3(GPIO_EMC_00) ; also sheet 6
SDRAM_DQ1 [sdram]: IC8.F3(GPIO_EMC_01) ; also sheet 6
SDRAM_DQ2 [sdram]: IC8.F4(GPIO_EMC_02) ; also sheet 6
SDRAM_DQ3 [sdram]: IC8.G4(GPIO_EMC_03) ; also sheet 6
SDRAM_DQ4 [sdram]: IC8.F2(GPIO_EMC_04) ; also sheet 6
SDRAM_DQ5 [sdram]: IC8.G5(GPIO_EMC_05) ; also sheet 6
SDRAM_DQ6 [sdram]: IC8.H5(GPIO_EMC_06) ; also sheet 6
SDRAM_DQ7 [sdram]: IC8.H4(GPIO_EMC_07) ; also sheet 6
SDRAM_DQ8 [sdram]: IC8.C6(GPIO_EMC_30) ; also sheet 6
SDRAM_DQ9 [sdram]: IC8.C5(GPIO_EMC_31) ; also sheet 6
SDRAM_DQ10 [sdram]: IC8.D5(GPIO_EMC_32) ; also sheet 6
SDRAM_DQ11 [sdram]: IC8.C4(GPIO_EMC_33) ; also sheet 6
SDRAM_DQ12 [sdram]: IC8.D4(GPIO_EMC_34) ; also sheet 6
SDRAM_DQ13 [sdram]: IC8.E5(GPIO_EMC_35) ; also sheet 6
SDRAM_DQ14 [sdram]: IC8.C3(GPIO_EMC_36) ; also sheet 6
SDRAM_DQ15 [sdram]: IC8.E4(GPIO_EMC_37) ; also sheet 6
SDRAM_DQMH [sdram]: IC8.D6(GPIO_EMC_38) ; also sheet 6
SDRAM_DQML [sdram]: IC8.H3(GPIO_EMC_08) ; also sheet 6
SDRAM_RAS [sdram]: IC8.D2(GPIO_EMC_25) ; also sheet 6
SDRAM_WE [sdram]: IC8.D1(GPIO_EMC_28) ; also sheet 6
USB_D_N [usb]: IC8.M8(USB_OTG1_DN) ; also sheet 1
USB_D_P [usb]: IC8.L8(USB_OTG1_DP) ; also sheet 1
VBUS: C88.1 C95.2 IC8.N6(USB_OTG1_VBUS) ; also sheet 1,2
VCC: C41.2 C43.1 C50.1 C53.1 C54.1 C55.1 C56.1 C57.2 C58.2 C64.1 C66.2 C67.1 C68.2 C86.2 C99.2 C108.2 C109.1 IC8.E6(NVCC_EMC_1) IC8.E9(NVCC_GPIO_1) IC8.F5(NVCC_EMC_2) IC8.F10(NVCC_GPIO_2) IC8.J6(NVCC_SD0) IC8.J10(NVCC_GPIO_3) IC8.K4(DCDC_IN_Q) IC8.K5(NVCC_SD1) IC8.L1(DCDC_IN_1) IC8.L2(DCDC_IN_2) IC8.P12(VDD_HIGH_IN) L6.2 R32.2 R33.1 R42.1 ; also sheet 3,5,6,7,8,9,10,11,12,13,14
VCC_SOC: C34.1 C38.1 C45.1 C46.2 C47.1 C48.1 C49.2 C87.2 C94.2 C97.2 C98.2 C100.2 C103.2 IC8.F6(VDD_SOC_IN_1) IC8.F7(VDD_SOC_IN_2) IC8.F8(VDD_SOC_IN_3) IC8.F9(VDD_SOC_IN_4) IC8.G6(VDD_SOC_IN_5) IC8.G9(VDD_SOC_IN_6) IC8.H6(VDD_SOC_IN_7) IC8.H9(VDD_SOC_IN_8) IC8.J5(DCDC_SENSE) IC8.J9(VDD_SOC_IN_9) L5.1
VDD_HIGH_CAP: C101.2 C102.1 IC8.P8(VDD_HIGH_CAP)
VDD_SNVS: C69.1 IC8.M9(VDD_SNVS_IN) ; also sheet 4,5
VDD_SNVS_CAP: C70.1 IC8.M10(VDD_SNVS_CAP)
VDD_USB_CAP: C71.1 C72.2 C73.2 IC8.K8(VDD_USB_CAP)
VDDA_ADC_3P3: C59.1 C60.2 C61.2 IC8.N14(VDDA_ADC_3P3) L6.1
WAKEUP: IC8.L6(WAKEUP) ; also sheet 4
WIFI_CLK [wifi]: IC8.M13(GPIO_AD_B1_09) ; also sheet 14
WIFI_CMD [wifi]: IC8.H13(GPIO_AD_B1_08) ; also sheet 14
WIFI_D0 [wifi]: IC8.M4(GPIO_SD_B1_03) ; also sheet 14
WIFI_D1 [wifi]: IC8.M3(GPIO_SD_B1_02) ; also sheet 14
WIFI_D2 [wifi]: IC8.J12(GPIO_AD_B1_06) ; also sheet 14
WIFI_D3 [wifi]: IC8.K10(GPIO_AD_B1_07) ; also sheet 14
WL_H_WAKE: IC8.E11(GPIO_B0_15) ; also sheet 14
WL_REG_ON: IC8.E10(GPIO_B0_14) ; also sheet 14
XTALI: C106.1 IC8.P11(XTALI) R40.1 Y2.3(CRYSTAL_2)
XTALO: C105.1 IC8.N11(XTALO) Y2.1(CRYSTAL_1)
Unconnected: IC8.B7(GPIO_EMC_39) IC8.L7(PMIC_STBY_REQ) IC8.N3(GPIO_SD_B1_05) IC8.N7(USB_OTG2_DN) IC8.N10(GPANAIO) IC8.N12(USB_OTG1_CHD_B) IC8.N13(CCM_CLK1_P) IC8.P6(USB_OTG2_VBUS) IC8.P7(USB_OTG2_DP) IC8.P13(CCM_CLK1_N)

### Notes on the sheet
- MIMXRT10XX
- SDRAM_DQS
- P_FLASH_DQS
- * PIN_F11 = BOOTMOD[0]
  BOOTMOD = b01 -> SBL BOOT
- Copyright (c) 2013-2023 OpenMV <openmv@openmv.io>
- This work is licensed under the Creative Commons Attribution-ShareAlike 3.0 License.
- To view a copy of this license, visit http://creativecommons.org/licenses/by-sa/3.0/